# Altium project Aeroval-v2.PrjPcb
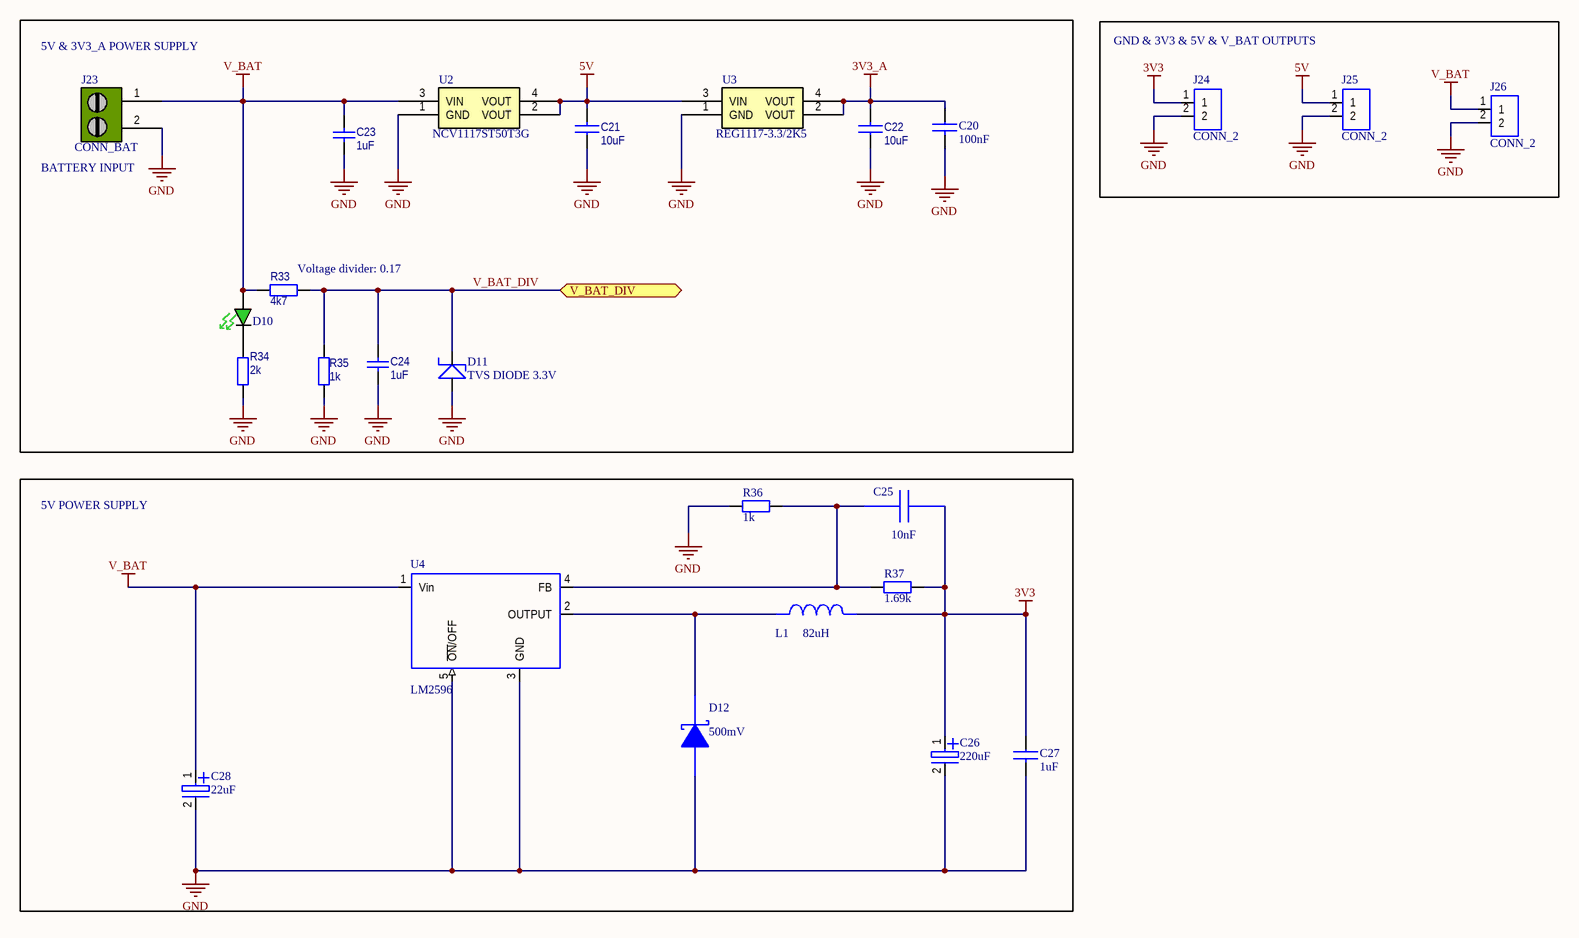
[diagram p0: Power_supply.SchDoc]
5 sheets, 208 parts. Net scope: flat (ports and power ports of the same name join across sheets).
Board files: Aeroval-v2-PCB1.PcbDoc, Aeroval-v2-PCB1-proto1.PcbDoc
Sheets:
  Power_supply.SchDoc
  Interfaces.SchDoc
  Sensors.SchDoc
  PWM.SchDoc
  uC.SchDoc

## Sheet Power_supply.SchDoc: Power supply
size A3; Author: Valentin Py; DrawnBy: Valentin Py; Engineer: Valentin Py; Address1: valentin.py@gmail.com; SheetNumber: 1; SheetTotal: 5; PageSetup: Record=PageOptions|CenterHorizontal=True|CenterVertical=True|PrintScale=0.24|XCorrection=1.00|YCorrection=1.00|PrintKind=0|BorderSize=5000000|LeftOffset=0|BottomOffset=0|Orientation=2|PaperLength=1000|PaperWidth=1000|Scale=100|PaperSource=7|PrintQuality=-4|MediaType=1|DitherType=10|PaperKind=A4|PrintScaleMode=1

### Parts
C20  100nF  [080503]
C21  10uF  [080501]
C22  10uF  [080501]
C23  1uF  [080503]
C24  1uF  [080503]
C25  10nF  [080503]
C26  220uF  [1411]
C27  1uF  [080503]
C28  22uF  [2413]
D10  LED  [LED_0805 - GREEN]  (value not drawn)
D11  TVS DIODE 3.3V  [SOD-523]
D12  value 500mV  [SMA]  (hidden comment: B230A-13-F)
J23  CONN_BAT  [SL508_2C]
J24  CONN_2  [640454-2]
J25  CONN_2  [640454-2]
J26  CONN_2  [640454-2]
L1  82uH  [L1]
R33  4k7  [060301]
R34  2k  [060301]
R35  1k  [060301]
R36  1k  [060301]
R37  1.69k  [060301]
U2  NCV1117ST50T3G  [SOT223]
U3  REG1117-3.3/2K5  [SOT223]
U4  LM2596  [TO263]

### Blocks framed on the sheet
GND & 3V3 & 5V & V_BAT OUTPUTS: J24-J26
5V POWER SUPPLY: C25-C28 D12 L1 R36 R37 U4

### Ports
V_BAT_DIV

### Nets
3V3: C25.1 C26.1 C27.1 J24.1 L1.2 R37.2
3V3_A: C20.1 C22.2 U3.2(VOUT) U3.4(VOUT)
5V: C21.2 J25.1 U2.2(VOUT) U2.4(VOUT) U3.3(VIN)
GND: C20.2 C21.1 C22.1 C23.2 C24.2 C26.2 C27.2 C28.2 D11.1 D12.2(A) J23.2 J24.2 J25.2 J26.2 R34.1 R35.2 R36.1 U2.1(GND) U3.1(GND) U4.3(GND) U4.5(~{ON}/OFF)
V_BAT: C23.1 C28.1 D10.A J23.1 J26.1 R33.2 U2.3(VIN) U4.1(Vin)
V_BAT_DIV: C24.1 D11.2 R33.1 R35.1 ; port V_BAT_DIV
NetC25_2: C25.2 R36.2 R37.1 U4.4(FB)
NetD10_C: D10.C R34.2
NetD12_1: D12.1(K) L1.1 U4.2(OUTPUT)

### Notes on the sheet
- (near J23) 5V & 3V3_A POWER SUPPLY
- (near J23) BATTERY INPUT
- (near R33) Voltage divider: 0.17
- Title
- Size:
- Date:
- A3
- Author:
- Time:
- Revision:
- Sheet
- of
- File:

### Library data of the parts
C20 = CAPA: CAP CER 0.1UF 25V 10% X7R 0805; Value: 100nF; Supplier 1: Digi-Key; Supplier Part Number 1: 1276-1099-1-ND
C21 C22 = CAPA: CAP CER 10UF 16V 20% X6S 0805; Value: 10uF; Supplier 1: Digi-Key; Supplier Part Number 1: 445-7612-1-ND
C23 C24 = Cap Semi: CAP CER 1UF 25V 10% X7R 0805; Value: 1uF; Supplier 1: Digi-Key; Supplier Part Number 1: 399-1168-1-ND
C25 = GRM216R71H103KA01D: CAP CER 10nF 50V 10% X7R 0805; Value: 10nF; Supplier 1: Digi-Key; Supplier Part Number 1: 399-1158-1-ND
C26 = CAPA_EL: CAP TANT 220UF 4V 20% 1411; Value: 220uF; Supplier 1: Digi-Key; Supplier Part Number 1: 399-4625-6-ND
C27 = CAPA: CAP CER 1UF 25V 10% X7R 0805; Value: 1uF; Supplier 1: Digi-Key; Supplier Part Number 1: 399-1168-1-ND
C28 = CAPA_EL: CAP TANT 22UF 25V 10% 2413; Value: 22uF; Supplier 1: Digi-Key; Supplier Part Number 1: 399-3746-1-ND
D10 = APT2012CGCK: LED 2X1.2MM 570NM GN WTR CLR SMD; Supplier 1: Digi-Key; Supplier Part Number 1: 754-1127-1-ND
D11 = Zener: TVS DIODE 3.3VWM 8VC SOD523; Supplier 1: Digi-Key; Supplier Part Number 1: 641-1395-1-ND
J23 = 282857-2: TERM BLOCK HDR 2POS R/A 5.08MM; Supplier 1: Digi-Key; Supplier Part Number 1: 281-1279-ND; Value: 282857-2
J24-J26 = CONN_2: CONN HEADER 2.54mm 2; Supplier 1: Stock
L1 = SDR1307-820KL: Value: 82uH; Supplier 1: Digi-Key; Supplier Part Number 1: SDR1307-820KLCT-ND
R33 = RES: RES 4.7K 1% 0603; Value: 4k7; Supplier 1: Digi-Key; Supplier Part Number 1: RMCF0603FT4K70CT-ND
R34 = RES: RES 2K 1% 0805; Value: 2k; Supplier 1: Digi-Key; Supplier Part Number 1: P2.00KHCT-ND
R35 R36 = RES: RES 1k 0805; Value: 1k; Supplier 1: Digi-Key
  R35: Supplier Part Number 1: P1.00KHDKR-ND
R37 = RES: RES 1.69K OHM 1% 1/8W 0805; Value: 1.69k; Supplier 1: Digi-Key; Supplier Part Number 1: P1.69KHCT-ND
U2 = NCV1117ST50T3G: Low Dropout (LDO) Regulators ANA 800mA LDO; Supplier 1: Digi-Key; Supplier Part Number 1: NCV1117ST50T3GOSCT-ND
U3 = NCV1117ST50T3G: IC REG LDO 3.3V 0.8A SOT223; Supplier 1: Digi-Key; Supplier Part Number 1: 296-21321-1-ND
U4 = LM2596: IC REG BUCK ADJ 3A TO263-5; Supplier 1: Digi-Key; Supplier Part Number 1: 296-35399-1-ND
D12 = B230A-13-F: Supplier 1: Digi-Key; Supplier Part Number 1: B230A-FDICT-ND

## Sheet Interfaces.SchDoc: Interfaces
size A3; Author: Valentin Py; DrawnBy: Valentin Py; Engineer: Valentin Py; Address1: valentin.py@gmail.com; SheetNumber: 3; SheetTotal: 5; PageSetup: Record=PageOptions|CenterHorizontal=True|CenterVertical=True|PrintScale=0.24|XCorrection=1.00|YCorrection=1.00|PrintKind=0|BorderSize=5000000|LeftOffset=0|BottomOffset=0|Orientation=2|PaperLength=1000|PaperWidth=1000|Scale=100|PaperSource=7|PrintQuality=-4|MediaType=1|DitherType=10|PaperKind=A4|PrintScaleMode=1
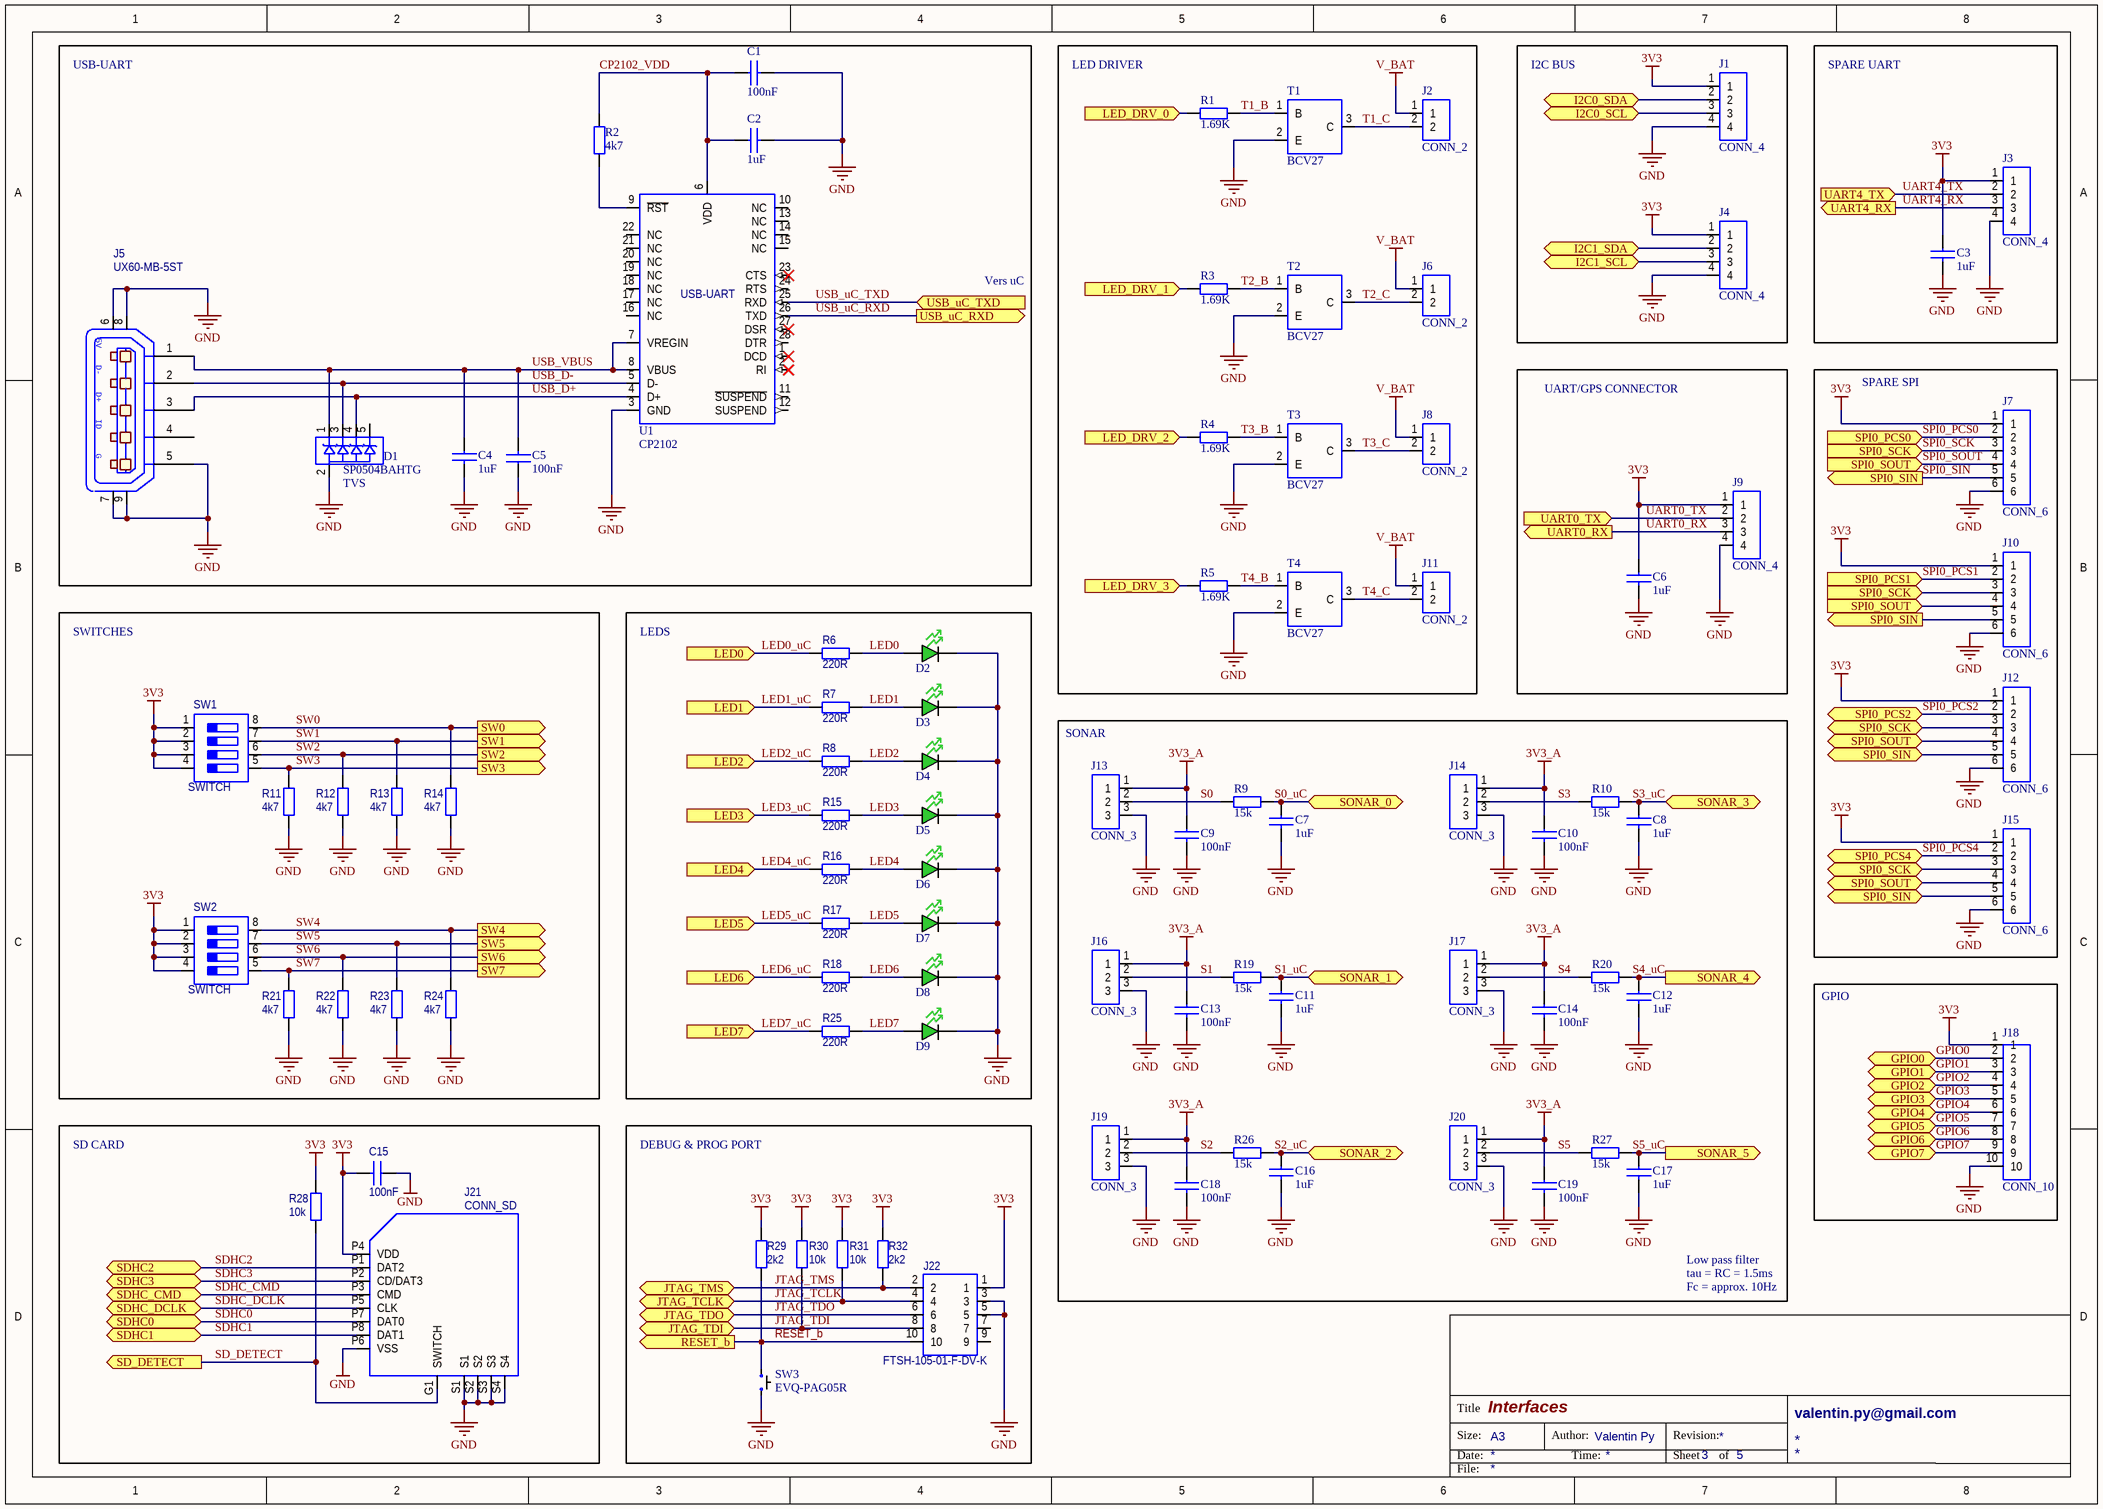
[diagram p1: Interfaces.SchDoc]

### Parts
C1  100nF  [080503]
C2  1uF  [080503]
C3  1uF  [080503]
C4  1uF  [080503]
C5  100nF  [080503]
C6  1uF  [080503]
C7  1uF  [080503]
C8  1uF  [080503]
C9  100nF  [080503]
C10  100nF  [080503]
C11  1uF  [080503]
C12  1uF  [080503]
C13  100nF  [080503]
C14  100nF  [080503]
C15  100nF  [080503]
C16  1uF  [080503]
C17  1uF  [080503]
C18  100nF  [080503]
C19  100nF  [080503]
D1  SP0504BAHTG  [SOT23501]
D2  LED  [LED_0805 - GREEN]  (value not drawn)
D3  LED  [LED_0805 - GREEN]  (value not drawn)
D4  LED  [LED_0805 - GREEN]  (value not drawn)
D5  LED  [LED_0805 - GREEN]  (value not drawn)
D6  LED  [LED_0805 - GREEN]  (value not drawn)
D7  LED  [LED_0805 - GREEN]  (value not drawn)
D8  LED  [LED_0805 - GREEN]  (value not drawn)
D9  LED  [LED_0805 - GREEN]  (value not drawn)
J1  CONN_4  [640454-4]
J2  CONN_2  [640454-2]
J3  CONN_4  [640454-4]
J4  CONN_4  [640454-4]
J5  UX60-MB-5ST  [USB/UX60-MB-5ST]
J6  CONN_2  [640454-2]
J7  CONN_6  [640454-6]
J8  CONN_2  [640454-2]
J9  CONN_4  [640454-4]
J10  CONN_6  [640454-6]
J11  CONN_2  [640454-2]
J12  CONN_6  [640454-6]
J13  CONN_3  [640454-3]
J14  CONN_3  [640454-3]
J15  CONN_6  [640454-6]
J16  CONN_3  [640454-3]
J17  CONN_3  [640454-3]
J18  CONN_10  [640454-10]
J19  CONN_3  [640454-3]
J20  CONN_3  [640454-3]
J21  CONN_SD  [con8_sdcard_push_sm]
J22  FTSH-105-01-F-DV-K  [FTSH-105-01-F-DV-K]
R1  1.69k  [060301]
R2  4k7  [060301]
R3  1.69k  [060301]
R4  1.69k  [060301]
R5  1.69k  [060301]
R6  220R  [060301]
R7  220R  [060301]
R8  220R  [060301]
R9  15k  [060301]
R10  15k  [060301]
R11  4k7  [060301]
R12  4k7  [060301]
R13  4k7  [060301]
R14  4k7  [060301]
R15  220R  [060301]
R16  220R  [060301]
R17  220R  [060301]
R18  220R  [060301]
R19  15k  [060301]
R20  15k  [060301]
R21  4k7  [060301]
R22  4k7  [060301]
R23  4k7  [060301]
R24  4k7  [060301]
R25  220R  [060301]
R26  15k  [060301]
R27  15k  [060301]
R28  10k  [060301]
R29  2k2  [060301]
R30  10k  [060301]
R31  10k  [060301]
R32  2k2  [060301]
SW1  SWITCH  [GDS04]
SW2  SWITCH  [GDS04]
SW3  EVQ-PAG05R  [EVQ-PAG05R]
T1  BCV27  [BCV27]
T2  BCV27  [BCV27]
T3  BCV27  [BCV27]
T4  BCV27  [BCV27]
U1  CP2102  [QFN-28]

### Blocks framed on the sheet
LED DRIVER: J2 J6 J8 J11 R1 R3-R5 T1-T4
I2C BUS: J1 J4
UART/GPS CONNECTOR: C6 J9
SPARE SPI: J7 J10 J12 J15
SWITCHES: R11-R14 R21-R24 SW1 SW2
LEDS: D2-D9 R6-R8 R15-R18 R25
GPIO: J18
SD CARD: C15 J21 R28
DEBUG & PROG PORT: J22 R29-R32 SW3

### Ports
GPIO0 (bidir), GPIO1 (bidir), GPIO2 (bidir), GPIO3 (bidir), GPIO4 (bidir), GPIO5 (bidir), GPIO6 (bidir), GPIO7 (bidir), I2C0_SCL (bidir), I2C0_SDA (bidir), I2C1_SCL, I2C1_SDA, JTAG_TCLK, JTAG_TDI, JTAG_TDO, JTAG_TMS, LED0 (in), LED1 (in), LED2 (in), LED3 (in), LED4 (in), LED5 (in), LED6 (in), LED7 (in), LED_DRV_0 (in), LED_DRV_1 (in), LED_DRV_2 (in), LED_DRV_3 (in), RESET_b (out), SD_DETECT (out), SDHC0, SDHC1, SDHC2, SDHC3, SDHC_CMD, SDHC_DCLK, SONAR_0, SONAR_1, SONAR_2, SONAR_3, SONAR_4 (out), SONAR_5 (out), SPI0_PCS0 (in), SPI0_PCS1 (in), SPI0_PCS2, SPI0_PCS4, SPI0_SCK, SPI0_SCK (in), SPI0_SIN, SPI0_SIN (out), SPI0_SOUT, SPI0_SOUT (in), SW0 (out), SW1 (out), SW2 (out), SW3 (out), SW4 (out), SW5 (out), SW6 (out), SW7 (out), UART0_RX (out), UART0_TX (in), UART4_RX (out), UART4_TX (in), USB_uC_RXD (out), USB_uC_TXD (in)

### Nets
3V3: C3.1 C6.1 C15.2 J1.1 J3.1 J4.1 J7.1 J9.1 J10.1 J12.1 J15.1 J18.1 J21.P4(VDD) J22.1 R28.1 R29.2 R30.1 R31.1 R32.2 SW1.1 SW1.2 SW1.3 SW1.4 SW2.1 SW2.2 SW2.3 SW2.4
3V3_A: C9.1 C10.1 C13.1 C14.1 C18.1 C19.1 J13.1 J14.1 J16.1 J17.1 J19.1 J20.1
GND: C1.2 C2.2 C3.2 C4.2 C5.1 C6.2 C7.2 C8.2 C9.2 C10.2 C11.2 C12.2 C13.2 C14.2 C15.1 C16.2 C17.2 C18.2 C19.2 D1.2 D2.C D3.C D4.C D5.C D6.C D7.C D8.C D9.C J1.4 J3.4 J4.4 J5.5(P5) J5.6(SHLD1) J5.7(SHLD2) J5.8(SHLD3) J5.9(SHLD4) J7.6 J9.4 J10.6 J12.6 J13.3 J14.3 J15.6 J16.3 J17.3 J18.10 J19.3 J20.3 J21.P6(VSS) J21.S1 J21.S2 J21.S3 J21.S4 J22.3 J22.5 R11.1 R12.1 R13.1 R14.1 R21.1 R22.1 R23.1 R24.1 SW3.B T1.2(E) T2.2(E) T3.2(E) T4.2(E) U1.3(GND)
V_BAT: J2.1 J6.1 J8.1 J11.1
CP2102_VDD: C1.1 C2.1 R2.2 U1.6(VDD)
GPIO0: J18.2 ; port GPIO0
GPIO1: J18.3 ; port GPIO1
GPIO2: J18.4 ; port GPIO2
GPIO3: J18.5 ; port GPIO3
GPIO4: J18.6 ; port GPIO4
GPIO5: J18.7 ; port GPIO5
GPIO6: J18.8 ; port GPIO6
GPIO7: J18.9 ; port GPIO7
I2C0_SCL: J1.3 ; port I2C0_SCL
I2C0_SDA: J1.2 ; port I2C0_SDA
I2C1_SCL: J4.3 ; port I2C1_SCL
I2C1_SDA: J4.2 ; port I2C1_SDA
JTAG_TCLK: J22.4 R31.2 ; port JTAG_TCLK
JTAG_TDI: J22.8 R30.2 ; port JTAG_TDI
JTAG_TDO: J22.6 ; port JTAG_TDO
JTAG_TMS: J22.2 R32.1 ; port JTAG_TMS
LED0: D2.A R6.2
LED0_uC: R6.1 ; port LED0
LED1: D3.A R7.2
LED1_uC: R7.1 ; port LED1
LED2: D4.A R8.2
LED2_uC: R8.1 ; port LED2
LED3: D5.A R15.2
LED3_uC: R15.1 ; port LED3
LED4: D6.A R16.2
LED4_uC: R16.1 ; port LED4
LED5: D7.A R17.2
LED5_uC: R17.1 ; port LED5
LED6: D8.A R18.2
LED6_uC: R18.1 ; port LED6
LED7: D9.A R25.2
LED7_uC: R25.1 ; port LED7
RESET_b: J22.10 R29.1 SW3.A ; port RESET_b
S0: J13.2 R9.1
S0_uC: C7.1 R9.2 ; port SONAR_0
S1: J16.2 R19.1
S1_uC: C11.1 R19.2 ; port SONAR_1
S2: J19.2 R26.1
S2_uC: C16.1 R26.2 ; port SONAR_2
S3: J14.2 R10.1
S3_uC: C8.1 R10.2 ; port SONAR_3
S4: J17.2 R20.1
S4_uC: C12.1 R20.2 ; port SONAR_4
S5: J20.2 R27.1
S5_uC: C17.1 R27.2 ; port SONAR_5
SD_DETECT: J21.G1(SWITCH) R28.2 ; port SD_DETECT
SDHC0: J21.P7(DAT0) ; port SDHC0
SDHC1: J21.P8(DAT1) ; port SDHC1
SDHC2: J21.P1(DAT2) ; port SDHC2
SDHC3: J21.P2(CD/DAT3) ; port SDHC3
SDHC_CMD: J21.P3(CMD) ; port SDHC_CMD
SDHC_DCLK: J21.P5(CLK) ; port SDHC_DCLK
SPI0_PCS0: J7.2 ; port SPI0_PCS0
SPI0_PCS1: J10.2 ; port SPI0_PCS1
SPI0_PCS2: J12.2 ; port SPI0_PCS2
SPI0_PCS4: J15.2 ; port SPI0_PCS4
SPI0_SCK: J7.3 J10.3 J12.3 J15.3 ; port SPI0_SCK
SPI0_SIN: J7.5 J10.5 J12.5 J15.5 ; port SPI0_SIN
SPI0_SOUT: J7.4 J10.4 J12.4 J15.4 ; port SPI0_SOUT
SW0: R14.2 SW1.8 ; port SW0
SW1: R13.2 SW1.7 ; port SW1
SW2: R12.2 SW1.6 ; port SW2
SW3: R11.2 SW1.5 ; port SW3
SW4: R24.2 SW2.8 ; port SW4
SW5: R23.2 SW2.7 ; port SW5
SW6: R22.2 SW2.6 ; port SW6
SW7: R21.2 SW2.5 ; port SW7
T1_B: R1.2 T1.1(B)
T1_C: J2.2 T1.3(C)
T2_B: R3.2 T2.1(B)
T2_C: J6.2 T2.3(C)
T3_B: R4.2 T3.1(B)
T3_C: J8.2 T3.3(C)
T4_B: R5.2 T4.1(B)
T4_C: J11.2 T4.3(C)
UART0_RX: J9.3 ; port UART0_RX
UART0_TX: J9.2 ; port UART0_TX
UART4_RX: J3.3 ; port UART4_RX
UART4_TX: J3.2 ; port UART4_TX
USB_D+: D1.4 J5.3(P3) U1.4(D+)
USB_D-: D1.3 J5.2(P2) U1.5(D-)
USB_uC_RXD: U1.26(TXD) ; port USB_uC_RXD
USB_uC_TXD: U1.25(RXD) ; port USB_uC_TXD
USB_VBUS: C4.1 C5.2 D1.1 J5.1(P1) U1.7(VREGIN) U1.8(VBUS)
NetR1_1: R1.1 ; port LED_DRV_0
NetR2_1: R2.1 U1.9(~{RST})
NetR3_1: R3.1 ; port LED_DRV_1
NetR4_1: R4.1 ; port LED_DRV_2
NetR5_1: R5.1 ; port LED_DRV_3

Not connected (* = marked no-connect by the designer): D1 5; J5 4(P4); J22 7 9; U1 1(DCD)* 2(RI)* 10(NC) 11(~{SUSPEND}) 12(SUSPEND) 13(NC) 14(NC) 15(NC) 16(NC) 17(NC) 18(NC) 19(NC) 20(NC) 21(NC) 22(NC) 23(CTS)* 24(RTS) 27(DSR)* 28(DTR)

### Notes on the sheet
- USB-UART
- SPARE UART
- Vers uC
- (near D1) TVS
- (near J13) SONAR
- Low pass filter
- tau = RC = 1.5ms
- Fc = approx. 10Hz
- Title
- Size:
- Date:
- A3
- Author:
- Time:
- Revision:
- Sheet
- of
- File:
- (in symbol CP2102) USB-UART
- (in symbol USB_MINI_AB_RECEPTACLE) 5V; D-; D+; ID; G

### Library data of the parts
C1 C5 C9 C10 C13-C15 C18 C19 = CAPA: CAP CER 0.1UF 25V 10% X7R 0805; Value: 100nF; Supplier 1: Digi-Key; Supplier Part Number 1: 1276-1099-1-ND
C2-C4 C6-C8 C11 C12 C16 C17 = CAPA: CAP CER 1UF 25V 10% X7R 0805; Value: 1uF; Supplier 1: Digi-Key; Supplier Part Number 1: 399-1168-1-ND
D1 = SP0504BAHTG: TVS AVAL DIODE ARRAY 4CH, 5.5V; Supplier 1: Digi-Key; Supplier Part Number 1: F3157CT-ND
D2-D9 = APT2012CGCK: LED 2X1.2MM 570NM GN WTR CLR SMD; Supplier 1: Digi-Key; Supplier Part Number 1: 754-1127-1-ND
J2 J6 J8 J11 = CONN_2: CONN HEADER 2.54mm 2; Supplier 1: Stock
J3 J9 = CONN_4: CONN HEADER 2.54mm 4; Supplier 1: Stock
J5 = USB_MINI_AB_RECEPTACLE: CONN RECEPT MINI B USB2.0; Supplier 1: Digi-Key; Supplier Part Number 1: H2959CT-ND
J13 J14 J16 J17 J19 J20 = CONN_3: CONN HEADER 2.54mm 3
  J13 J14 J16 J19: Supplier 1: Stocks
  J17 J20: Supplier 1: Stock
J21 = CON8_SDCARD_SW: CON 8 SD CARD PUSH SMT 1.1MM SP 75H AU; Supplier 1: Digi-Key; Supplier Part Number 1: WM6825CT-ND
J22 = CON10A: CONN HEADER 10POS DUAL .05" SMD; Supplier 1: Digi-Key; Supplier Part Number 1: FTSH-105-01-F-DV-K-ND
R1 R3-R5 = RES: RES 1.69K OHM 1% 1/8W 0805; Value: 1.69K; Supplier 1: Digi-Key; Supplier Part Number 1: P1.69KHCT-ND
R2 R11-R14 R21-R24 = RES: RES 4.7K 0805; Value: 4k7; Supplier 1: Digi-Key; Supplier Part Number 1: RMCF0603FT4K70CT-ND
R6-R8 R15-R18 R25 = RES: RES 220R 0805; Value: 220R; Supplier 1: Digi-Key; Supplier Part Number 1: RMCF0603FT220RCT-ND
R9 R10 R19 R20 R26 R27 = RES: RES 15K 0805; Value: 15k; Supplier 1: Digi-Key; Supplier Part Number 1: RHM15.0KCFCT-ND
R28 R30 R31 = RES: RES 10K 0805; Value: 10k; Supplier 1: Digi-Key; Supplier Part Number 1: RHM10.0KCFCT-ND
R29 R32 = RES: RES 2.2k 0805; Value: 2k2; Supplier 1: Digi-Key; Supplier Part Number 1: RMCF0603FT2K20CT-ND
SW1 SW2 = SW DIP-4: SWITCH DIP TOP SLIDE 4POS SMD; Supplier 1: Digi-Key; Supplier Part Number 1: CKN6068-ND
SW3 = EVQ-PAG05R: SWITCH LT 6MM 260GF 5MM HEIGHT; Value: EVQ-PAG05R; Supplier 1: Digi-Key; Supplier Part Number 1: P12195S-ND
T1-T4 = BCV27: TRANS NPN DARL 30V 1.2A SOT23; Supplier 1: Digi-Key; Supplier Part Number 1: BCV27CT-ND
U1 = CP2102: Single-Chip USB to UART Bridge; Value: *; Supplier 1: Digi-Key; Supplier Part Number 1: 336-1160-5-ND

## Sheet Sensors.SchDoc: Sensors
size A3; Author: Valentin Py; DrawnBy: Valentin Py; Engineer: Valentin Py; Address1: valentin.py@gmail.com; SheetNumber: 2; SheetTotal: 5; PageSetup: Record=PageOptions|CenterHorizontal=True|CenterVertical=True|PrintScale=0.24|XCorrection=1.00|YCorrection=1.00|PrintKind=0|BorderSize=5000000|LeftOffset=0|BottomOffset=0|Orientation=2|PaperLength=1000|PaperWidth=1000|Scale=100|PaperSource=7|PrintQuality=-4|MediaType=1|DitherType=10|PaperKind=A4|PrintScaleMode=1
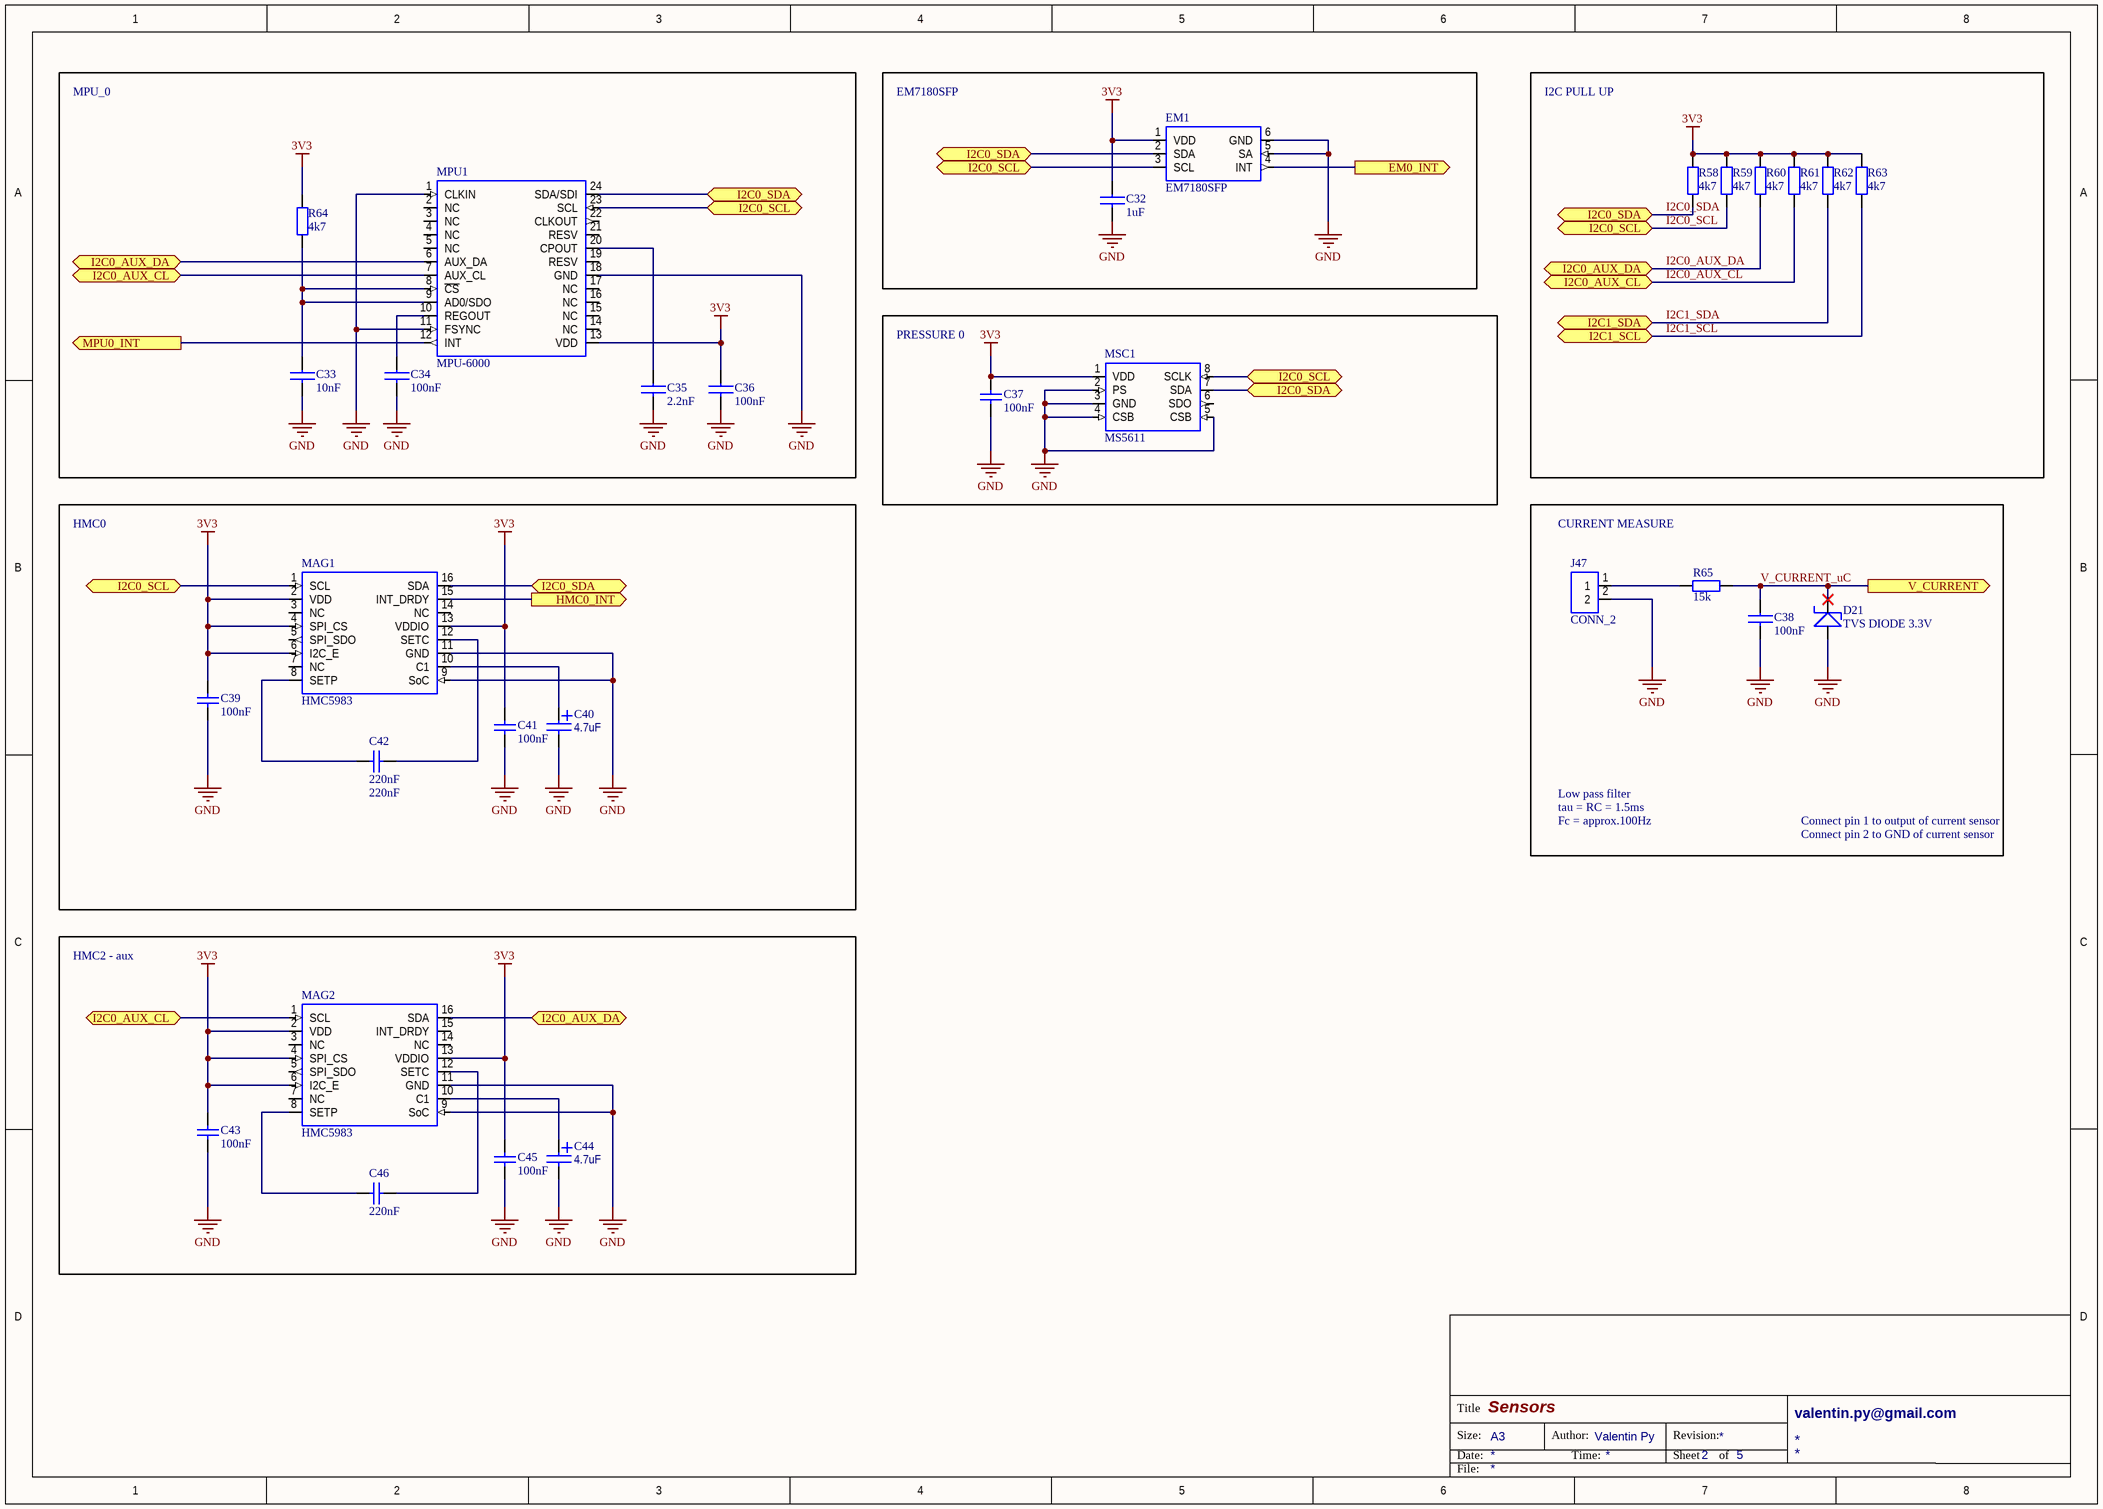
[diagram p2: Sensors.SchDoc]

### Parts
C32  1uF  [080503]
C33  10nF  [080503]
C34  100nF  [080503]
C35  2.2nF  [080503]
C36  100nF  [080503]
C37  100nF  [080503]
C38  100nF  [080503]
C39  100nF  [080503]
C40  4.7uF  [120605]
C41  100nF  [080503]
C42  220nF  [080503]
C43  100nF  [080503]
C44  4.7uF  [120605]
C45  100nF  [080503]
C46  220nF  [080503]
D21  TVS DIODE 3.3V  [SOD-523]
EM1  EM7180SFP  [EM7180SFP]
J47  CONN_2  [640454-2]
MAG1  HMC5983  [QFN16]
MAG2  HMC5983  [QFN16]
MPU1  MPU-6000  [QFN24]
MSC1  MS5611  [MS5611]
R58  4k7  [060301]
R59  4k7  [060301]
R60  4k7  [060301]
R61  4k7  [060301]
R62  4k7  [060301]
R63  4k7  [060301]
R64  4k7  [060301]
R65  15k  [060301]

### Blocks framed on the sheet
MPU_0: C33-C36 MPU1 R64
EM7180SFP: C32 EM1
I2C PULL UP: R58-R63
PRESSURE 0: C37 MSC1
HMC0: C39-C42 MAG1
HMC2 - aux: C43-C46 MAG2

### Ports
EM0_INT (out), HMC0_INT (out), I2C0_AUX_CL (bidir), I2C0_AUX_DA (bidir), I2C0_SCL (bidir), I2C0_SDA (bidir), I2C1_SCL, I2C1_SDA, MPU0_INT (out), V_CURRENT (out)

### Nets
3V3: C32.1 C36.1 C37.2 C39.1 C41.1 C43.1 C45.1 EM1.1(VDD) MAG1.2(VDD) MAG1.4(SPI_CS) MAG1.6(I2C_E) MAG1.13(VDDIO) MAG2.2(VDD) MAG2.4(SPI_CS) MAG2.6(I2C_E) MAG2.13(VDDIO) MPU1.13(VDD) MSC1.1(VDD) R58.2 R59.2 R60.2 R61.2 R62.2 R63.2 R64.2
GND: C32.2 C33.2 C34.2 C35.2 C36.2 C37.1 C38.2 C39.2 C40.2 C41.2 C43.2 C44.2 C45.2 D21.1 EM1.5(SA) EM1.6(GND) J47.2 MAG1.9(SoC) MAG1.11(GND) MAG2.9(SoC) MAG2.11(GND) MPU1.1(CLKIN) MPU1.11(FSYNC) MPU1.18(GND) MSC1.2(PS) MSC1.3(GND) MSC1.4(CSB) MSC1.5(CSB)
I2C0_AUX_CL: MAG2.1(SCL) MPU1.7(AUX_CL) R61.1 ; port I2C0_AUX_CL
I2C0_AUX_DA: MAG2.16(SDA) MPU1.6(AUX_DA) R60.1 ; port I2C0_AUX_DA
I2C0_SCL: EM1.3(SCL) MAG1.1(SCL) MPU1.23(SCL) MSC1.8(SCLK) R59.1 ; port I2C0_SCL
I2C0_SDA: EM1.2(SDA) MAG1.16(SDA) MPU1.24(SDA/SDI) MSC1.7(SDA) R58.1 ; port I2C0_SDA
I2C1_SCL: R63.1 ; port I2C1_SCL
I2C1_SDA: R62.1 ; port I2C1_SDA
V_CURRENT_uC: C38.1 D21.2 R65.2 ; port V_CURRENT
NetC33_1: C33.1 MPU1.8(~{CS}) MPU1.9(AD0/SDO) R64.1
NetC34_1: C34.1 MPU1.10(REGOUT)
NetC35_1: C35.1 MPU1.20(CPOUT)
NetC40_1: C40.1 MAG1.10(C1)
NetC42_1: C42.1 MAG1.12(SETC)
NetC42_2: C42.2 MAG1.8(SETP)
NetC44_1: C44.1 MAG2.10(C1)
NetC46_1: C46.1 MAG2.12(SETC)
NetC46_2: C46.2 MAG2.8(SETP)
NetEM1_4: EM1.4(INT) ; port EM0_INT
NetJ47_1: J47.1 R65.1
NetMAG1_15: MAG1.15(INT_DRDY) ; port HMC0_INT
NetMPU1_12: MPU1.12(INT) ; port MPU0_INT

Not connected (* = marked no-connect by the designer): MAG1 3(NC) 5(SPI_SDO) 7(NC) 14(NC); MAG2 3(NC) 5(SPI_SDO) 7(NC) 14(NC) 15(INT_DRDY); MPU1 2(NC) 3(NC) 4(NC) 5(NC) 14(NC) 15(NC) 16(NC) 17(NC) 19(RESV) 21(RESV) 22(CLKOUT); MSC1 6(SDO)

### Notes on the sheet
- CURRENT MEASURE
- Low pass filter
- tau = RC = 1.5ms
- Fc = approx.100Hz
- Connect pin 1 to output of current sensor
- Connect pin 2 to GND of current sensor
- Title
- Size:
- Date:
- A3
- Author:
- Time:
- Revision:
- Sheet
- of
- File:

### Library data of the parts
C32 = CAPA: CAP CER 1UF 25V 10% X7R 0805; Value: 1uF; Supplier 1: Digi-Key; Supplier Part Number 1: 399-1168-1-ND
C33 = CAPA: CAP CER 10nF 50V 10% X7R 0805; Value: 10nF; Supplier 1: Digi-Key; Supplier Part Number 1: 399-1158-1-ND
C34 C36 C38 = CAPA: CAP CER 0.1UF 25V 10% X7R 0805; Value: 100nF; Supplier 1: Digi-Key; Supplier Part Number 1: 1276-1099-1-ND
C35 = CAPA: CAP CER 2.2nF 50V; Value: 2.2nF; Supplier 1: Digi-Key; Supplier Part Number 1: 399-11167-2-ND
C37 C39 C41 C43 C45 = CAP: CAP CER 0.1UF 25V 10% X7R 0805; Value: 100nF; Supplier 1: Digi-Key; Supplier Part Number 1: 1276-1099-1-ND
C40 C44 = CAPA_T: CAP TANT 4.7uF 10V 10% 1206; Value: 4.7uF; Supplier 1: Digi-Key; Supplier Part Number 1: 399-3696-1-ND
C42 C46 = CAP: CAP CER 0.22uF 50V X7R 10% 0805; Value: 220nF; Supplier 1: Digi-Key; Supplier Part Number 1: 399-3491-1-ND
D21 = Zener: TVS DIODE 3.3VWM 8VC SOD523; Supplier 1: Digi-Key; Supplier Part Number 1: 641-1395-1-ND
J47 = CONN_2: CONN HEADER 2.54mm 2; Supplier 1: Stock
MAG1 MAG2 = HMC5983: IC COMPASS 3 AXIS 16-LCC; Supplier 1: Digi-Key; Supplier Part Number 1: 342-1092-1-ND
MPU1 = MPU-6000: GYRO/ACCELEROMETER 6AXIS 24QFN; Supplier 1: Digi-Key; Supplier Part Number 1: 1428-1005-1-ND
R58-R64 = RES: RES 4.7K 0805; Value: 4k7; Supplier 1: Digi-Key; Supplier Part Number 1: RMCF0603FT4K70CT-ND
R65 = RES: RES 15K 0805; Value: 15k; Supplier 1: Digi-Key; Supplier Part Number 1: RHM15.0KCFCT-ND

## Sheet PWM.SchDoc: PWM Connectors
size A3; Author: Valentin Py; DrawnBy: Valentin Py; Engineer: Valentin Py; Address1: valentin.py@gmail.com; SheetNumber: 5; SheetTotal: 5; PageSetup: Record=PageOptions|CenterHorizontal=True|CenterVertical=True|PrintScale=0.24|XCorrection=1.00|YCorrection=1.00|PrintKind=0|BorderSize=5000000|LeftOffset=0|BottomOffset=0|Orientation=2|PaperLength=1000|PaperWidth=1000|Scale=100|PaperSource=7|PrintQuality=-4|MediaType=1|DitherType=10|PaperKind=A4|PrintScaleMode=1
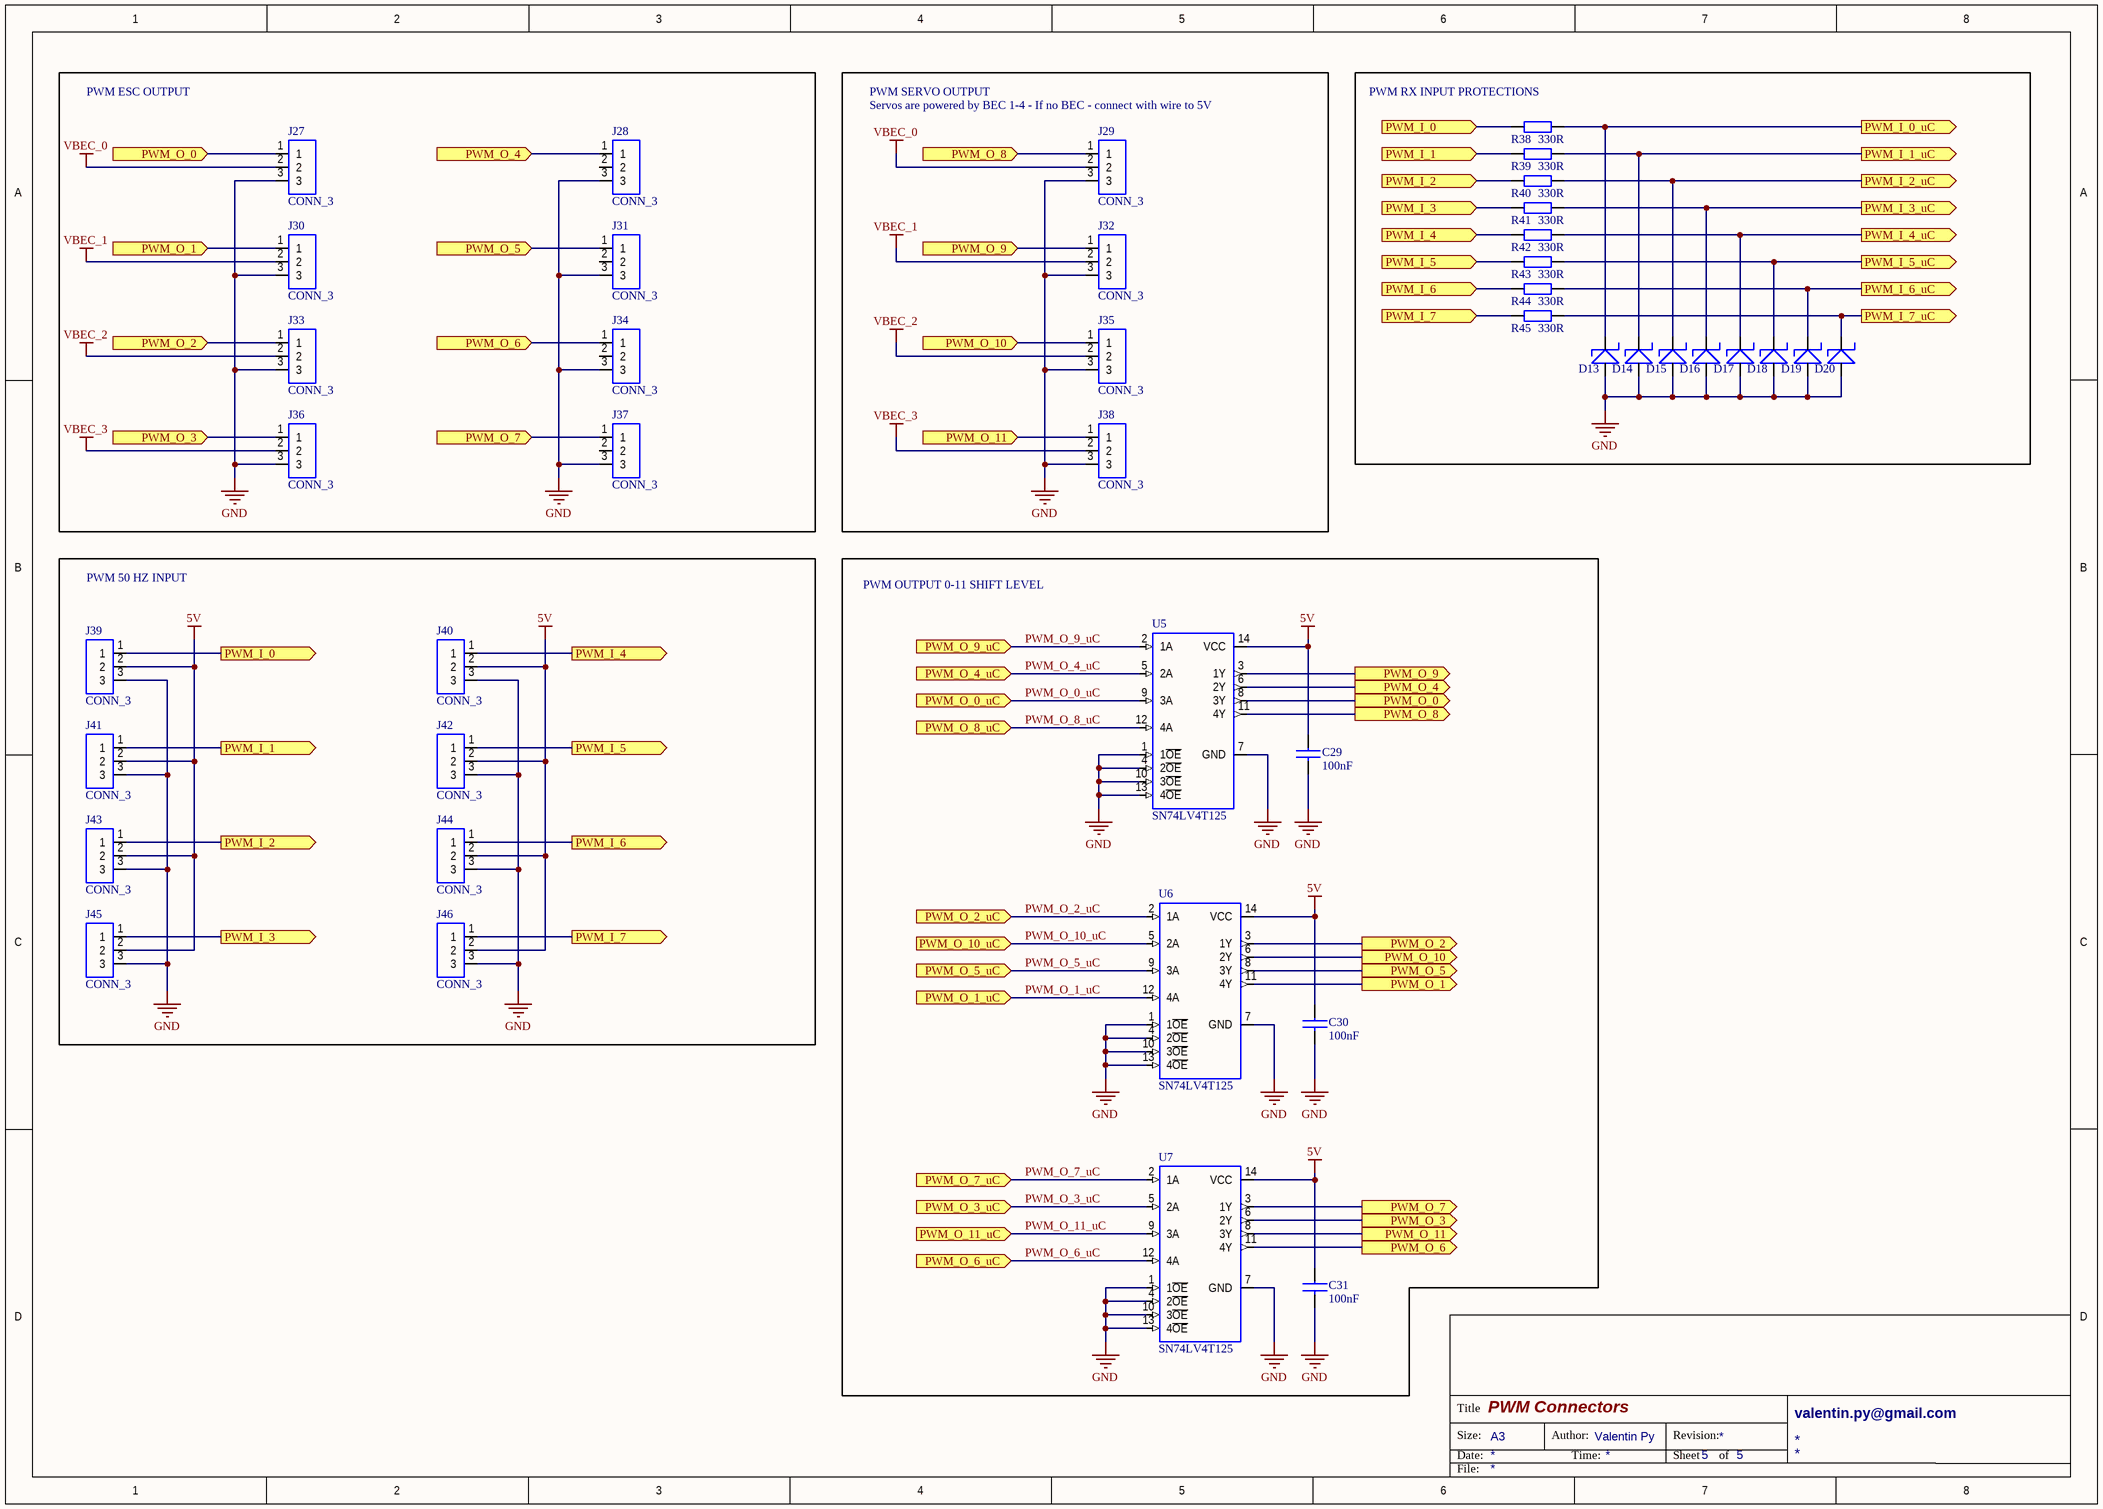
[diagram p3: PWM.SchDoc]

### Parts
C29  100nF  [080503]
C30  100nF  [080503]
C31  100nF  [080503]
D13  TVS DIODE 3.3V  [SOD-523]  (value not drawn)
D14  TVS DIODE 3.3V  [SOD-523]  (value not drawn)
D15  TVS DIODE 3.3V  [SOD-523]  (value not drawn)
D16  TVS DIODE 3.3V  [SOD-523]  (value not drawn)
D17  TVS DIODE 3.3V  [SOD-523]  (value not drawn)
D18  TVS DIODE 3.3V  [SOD-523]  (value not drawn)
D19  TVS DIODE 3.3V  [SOD-523]  (value not drawn)
D20  TVS DIODE 3.3V  [SOD-523]  (value not drawn)
J27  CONN_3  [640454-3]
J28  CONN_3  [640454-3]
J29  CONN_3  [640454-3]
J30  CONN_3  [640454-3]
J31  CONN_3  [640454-3]
J32  CONN_3  [640454-3]
J33  CONN_3  [640454-3]
J34  CONN_3  [640454-3]
J35  CONN_3  [640454-3]
J36  CONN_3  [640454-3]
J37  CONN_3  [640454-3]
J38  CONN_3  [640454-3]
J39  CONN_3  [640454-3]
J40  CONN_3  [640454-3]
J41  CONN_3  [640454-3]
J42  CONN_3  [640454-3]
J43  CONN_3  [640454-3]
J44  CONN_3  [640454-3]
J45  CONN_3  [640454-3]
J46  CONN_3  [640454-3]
R38  330R  [060301]
R39  330R  [060301]
R40  330R  [060301]
R41  330R  [060301]
R42  330R  [060301]
R43  330R  [060301]
R44  330R  [060301]
R45  330R  [060301]
U5  SN74LV4T125  [TSSOP14]
U6  SN74LV4T125  [TSSOP14]
U7  SN74LV4T125  [TSSOP14]

### Blocks framed on the sheet
PWM ESC OUTPUT: J27 J28 J30 J31 J33 J34 J36 J37
PWM RX INPUT PROTECTIONS: D13-D20 R38-R45
PWM 50 HZ INPUT: J39-J46
PWM OUTPUT 0-11 SHIFT LEVEL: C29-C31 U5-U7

### Ports
PWM_I_0 (in), PWM_I_0 (out), PWM_I_0_uC (out), PWM_I_1 (in), PWM_I_1 (out), PWM_I_1_uC (out), PWM_I_2 (in), PWM_I_2 (out), PWM_I_2_uC (out), PWM_I_3 (in), PWM_I_3 (out), PWM_I_3_uC (out), PWM_I_4 (in), PWM_I_4 (out), PWM_I_4_uC (out), PWM_I_5 (in), PWM_I_5 (out), PWM_I_5_uC (out), PWM_I_6 (in), PWM_I_6 (out), PWM_I_6_uC (out), PWM_I_7 (in), PWM_I_7 (out), PWM_I_7_uC (out), PWM_O_0 (in), PWM_O_0 (out), PWM_O_0_uC (in), PWM_O_1 (in), PWM_O_1 (out), PWM_O_1_uC (in), PWM_O_2 (in), PWM_O_2 (out), PWM_O_2_uC (in), PWM_O_3 (in), PWM_O_3 (out), PWM_O_3_uC (in), PWM_O_4 (in), PWM_O_4 (out), PWM_O_4_uC (in), PWM_O_5 (in), PWM_O_5 (out), PWM_O_5_uC (in), PWM_O_6 (in), PWM_O_6 (out), PWM_O_6_uC (in), PWM_O_7 (in), PWM_O_7 (out), PWM_O_7_uC (in), PWM_O_8 (in), PWM_O_8 (out), PWM_O_8_uC (in), PWM_O_9 (in), PWM_O_9 (out), PWM_O_9_uC (in), PWM_O_10 (in), PWM_O_10 (out), PWM_O_10_uC (in), PWM_O_11 (in), PWM_O_11 (out), PWM_O_11_uC (in)

### Nets
5V: C29.1 C30.1 C31.1 J39.2 J40.2 J41.2 J42.2 J43.2 J44.2 J45.2 J46.2 U5.14(VCC) U6.14(VCC) U7.14(VCC)
GND: C29.2 C30.2 C31.2 D13.1 D14.1 D15.1 D16.1 D17.1 D18.1 D19.1 D20.1 J27.3 J28.3 J29.3 J30.3 J31.3 J32.3 J33.3 J34.3 J35.3 J36.3 J37.3 J38.3 J39.3 J40.3 J41.3 J42.3 J43.3 J44.3 J45.3 J46.3 U5.1(1~{OE}) U5.4(2~{OE}) U5.7(GND) U5.10(3~{OE}) U5.13(4~{OE}) U6.1(1~{OE}) U6.4(2~{OE}) U6.7(GND) U6.10(3~{OE}) U6.13(4~{OE}) U7.1(1~{OE}) U7.4(2~{OE}) U7.7(GND) U7.10(3~{OE}) U7.13(4~{OE})
VBEC_0: J27.2 J29.2
VBEC_1: J30.2 J32.2
VBEC_2: J33.2 J35.2
VBEC_3: J36.2 J38.2
PWM_O_0_uC: U5.9(3A) ; port PWM_O_0_uC
PWM_O_1_uC: U6.12(4A) ; port PWM_O_1_uC
PWM_O_2_uC: U6.2(1A) ; port PWM_O_2_uC
PWM_O_3_uC: U7.5(2A) ; port PWM_O_3_uC
PWM_O_4_uC: U5.5(2A) ; port PWM_O_4_uC
PWM_O_5_uC: U6.9(3A) ; port PWM_O_5_uC
PWM_O_6_uC: U7.12(4A) ; port PWM_O_6_uC
PWM_O_7_uC: U7.2(1A) ; port PWM_O_7_uC
PWM_O_8_uC: U5.12(4A) ; port PWM_O_8_uC
PWM_O_9_uC: U5.2(1A) ; port PWM_O_9_uC
PWM_O_10_uC: U6.5(2A) ; port PWM_O_10_uC
PWM_O_11_uC: U7.9(3A) ; port PWM_O_11_uC
NetD13_2: D13.2 R38.1 ; port PWM_I_0_uC
NetD14_2: D14.2 R39.1 ; port PWM_I_1_uC
NetD15_2: D15.2 R40.1 ; port PWM_I_2_uC
NetD16_2: D16.2 R41.1 ; port PWM_I_3_uC
NetD17_2: D17.2 R42.1 ; port PWM_I_4_uC
NetD18_2: D18.2 R43.1 ; port PWM_I_5_uC
NetD19_2: D19.2 R44.1 ; port PWM_I_6_uC
NetD20_2: D20.2 R45.1 ; port PWM_I_7_uC
NetJ27_1: J27.1 U5.8(3Y) ; port PWM_O_0
NetJ28_1: J28.1 U5.6(2Y) ; port PWM_O_4
NetJ29_1: J29.1 U5.11(4Y) ; port PWM_O_8
NetJ30_1: J30.1 U6.11(4Y) ; port PWM_O_1
NetJ31_1: J31.1 U6.8(3Y) ; port PWM_O_5
NetJ32_1: J32.1 U5.3(1Y) ; port PWM_O_9
NetJ33_1: J33.1 U6.3(1Y) ; port PWM_O_2
NetJ34_1: J34.1 U7.11(4Y) ; port PWM_O_6
NetJ35_1: J35.1 U6.6(2Y) ; port PWM_O_10
NetJ36_1: J36.1 U7.6(2Y) ; port PWM_O_3
NetJ37_1: J37.1 U7.3(1Y) ; port PWM_O_7
NetJ38_1: J38.1 U7.8(3Y) ; port PWM_O_11
NetJ39_1: J39.1 R38.2 ; port PWM_I_0
NetJ40_1: J40.1 R42.2 ; port PWM_I_4
NetJ41_1: J41.1 R39.2 ; port PWM_I_1
NetJ42_1: J42.1 R43.2 ; port PWM_I_5
NetJ43_1: J43.1 R40.2 ; port PWM_I_2
NetJ44_1: J44.1 R44.2 ; port PWM_I_6
NetJ45_1: J45.1 R41.2 ; port PWM_I_3
NetJ46_1: J46.1 R45.2 ; port PWM_I_7

Not connected (* = marked no-connect by the designer): J28 2; J31 2; J34 2; J37 2

### Notes on the sheet
- PWM SERVO OUTPUT
- (near J29) Servos are powered by BEC 1-4 - If no BEC - connect with wire to 5V
- Title
- Size:
- Date:
- A3
- Author:
- Time:
- Revision:
- Sheet
- of
- File:

### Library data of the parts
C29-C31 = CAPA: CAP CER 0.1UF 25V 10% X7R 0805; Value: 100nF; Supplier 1: Digi-Key; Supplier Part Number 1: 1276-1099-1-ND
D13-D20 = Zener: TVS DIODE 3.3VWM 8VC SOD523; Supplier 1: Digi-Key; Supplier Part Number 1: 641-1395-1-ND
J27-J46 = CONN_3: CONN HEADER 2.54mm 3; Supplier 1: Stock
R38-R45 = RES: RES 330R 0805; Value: 330R; Supplier 1: Digi-Key; Supplier Part Number 1: RHM330CFCT-ND
U5-U7 = SN74LV4T125: IC BUFF/DVR NON-INVERT 14TSSOP; Supplier 1: Digi-Key; Supplier Part Number 1: 296-40545-1-ND

## Sheet uC.SchDoc: Microcontroller
size A3; Author: Valentin Py; DrawnBy: Valentin Py; Engineer: Valentin Py; Address1: valentin.py@gmail.com; SheetNumber: 4; SheetTotal: 5; PageSetup: Record=PageOptions|CenterHorizontal=True|CenterVertical=True|PrintScale=0.24|XCorrection=1.00|YCorrection=1.00|PrintKind=0|BorderSize=5000000|LeftOffset=0|BottomOffset=0|Orientation=2|PaperLength=1000|PaperWidth=1000|Scale=100|PaperSource=7|PrintQuality=-4|MediaType=1|DitherType=10|PaperKind=A4|PrintScaleMode=1
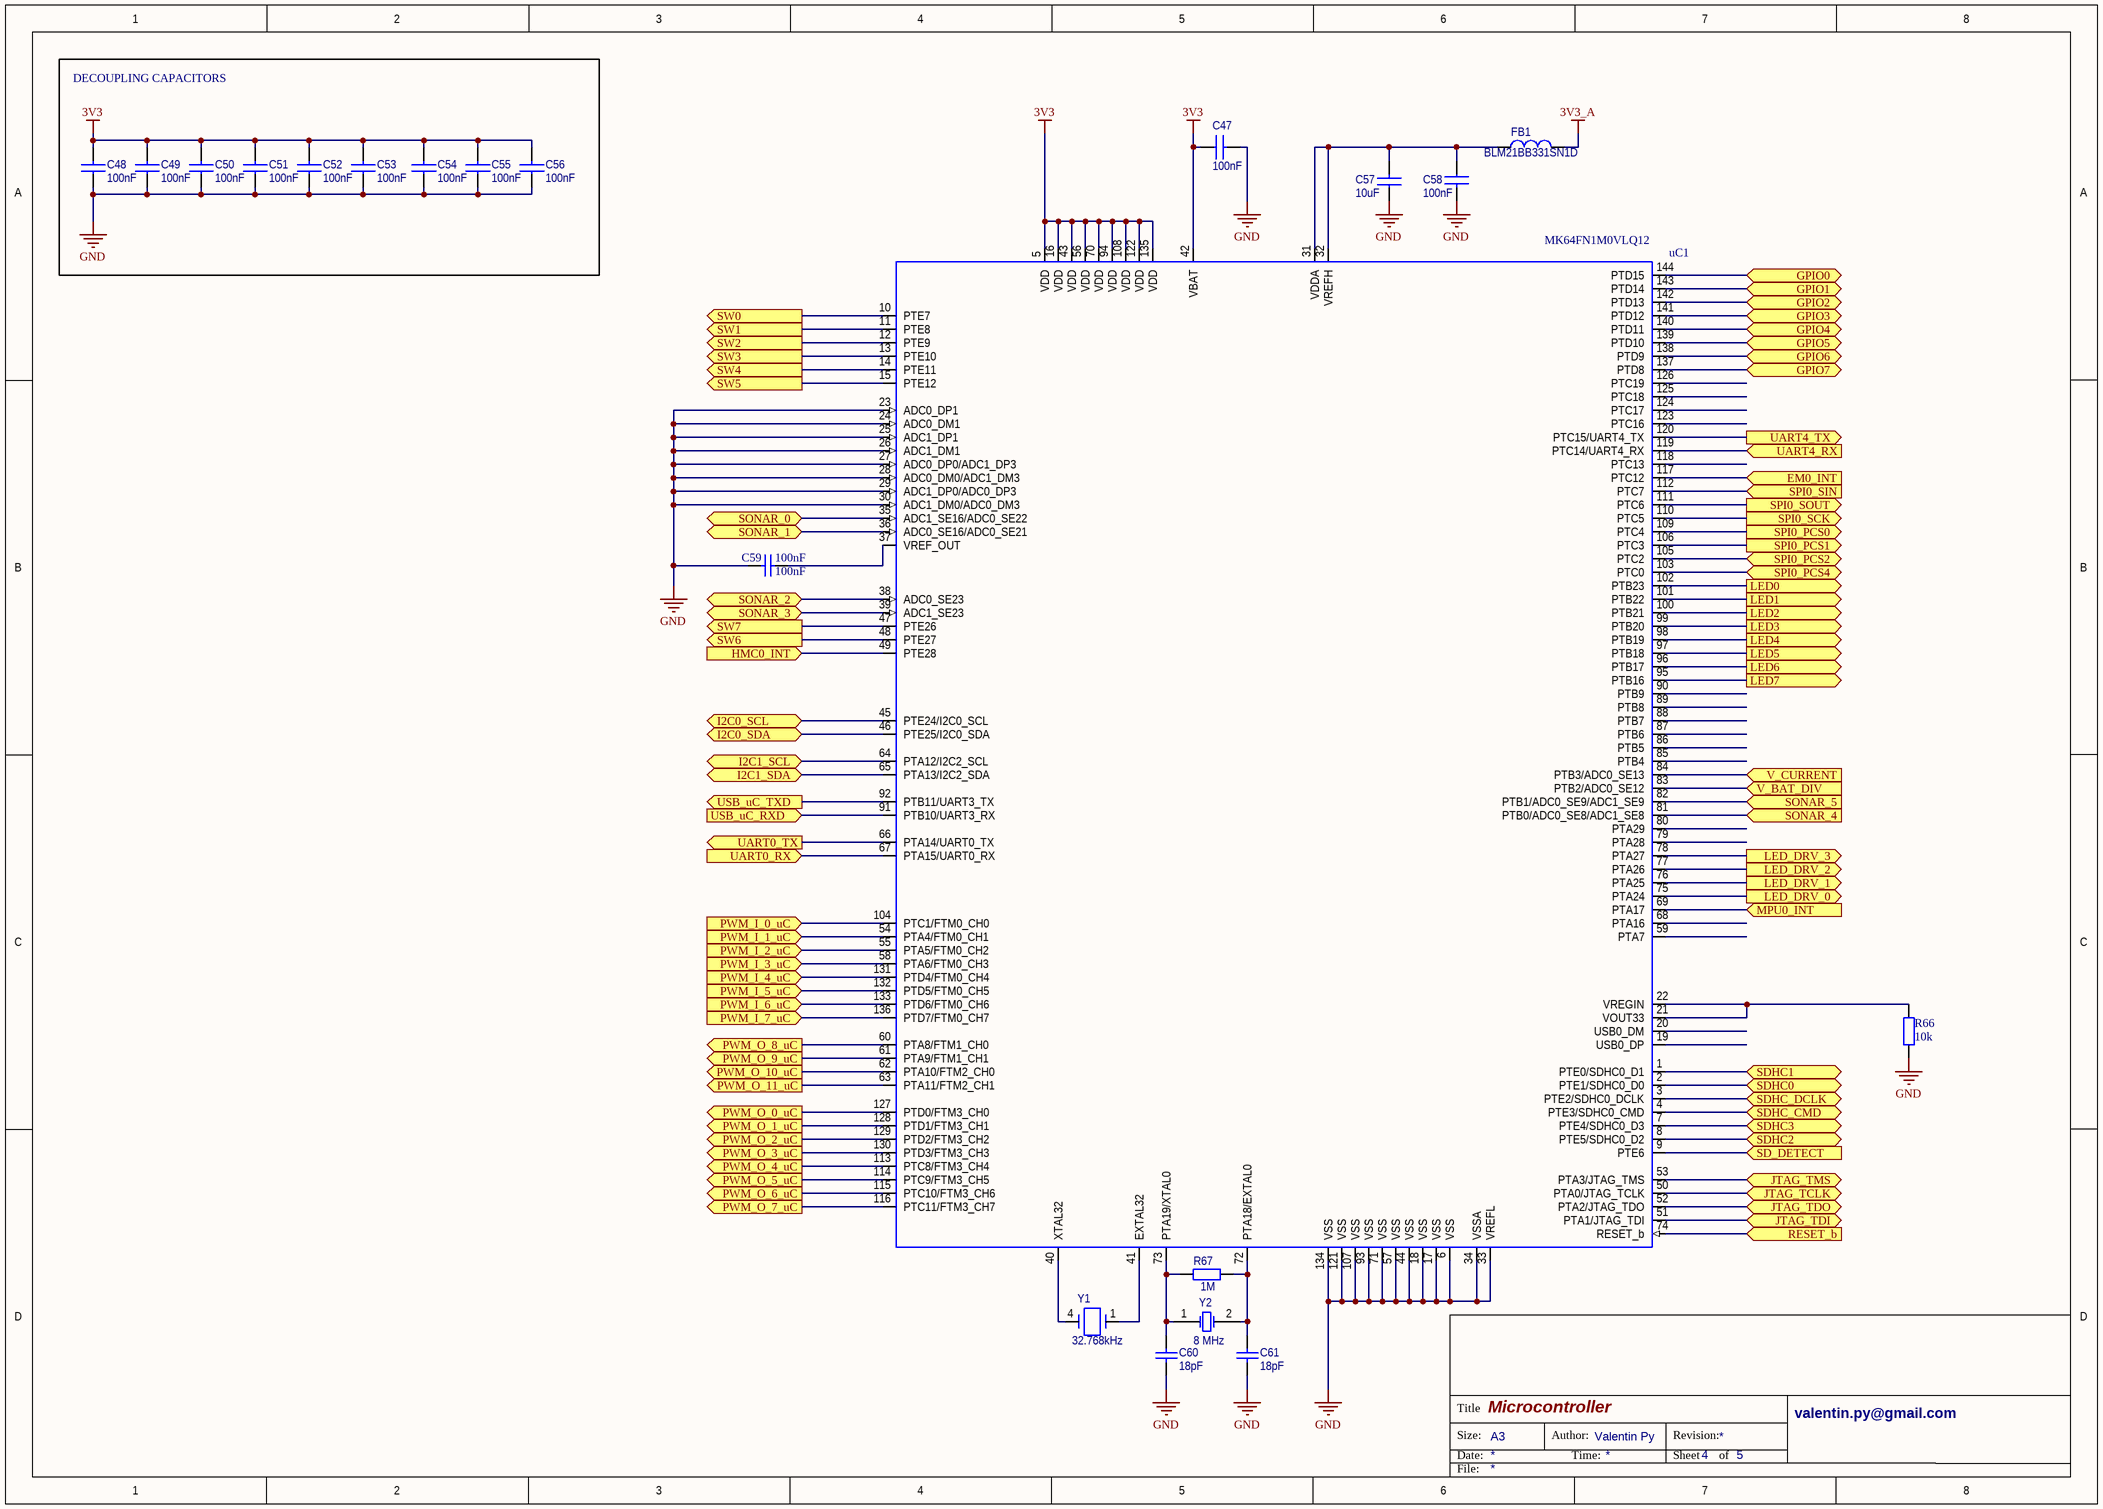
[diagram p4: uC.SchDoc]

### Parts
C47  100nF  [080503]
C48  100nF  [080503]
C49  100nF  [080503]
C50  100nF  [080503]
C51  100nF  [080503]
C52  100nF  [080503]
C53  100nF  [080503]
C54  100nF  [080503]
C55  100nF  [080503]
C56  100nF  [080503]
C57  10uF  [080503]
C58  100nF  [080503]
C59  100nF  [080503]
C60  18pF  [060301]
C61  18pF  [060301]
FB1  BLM21BB331SN1D  [080501]
R66  10k  [060301]
R67  1M  [060301]
uC1  MK64FN1M0VLQ12  [LQFP 144]
Y1  value 32.768kHz  [XT-5]  (hidden comment: CRYSTAL 32.768k)
Y2  value 8 MHz  [XT8_2-SMD]  (hidden comment: ABM3-8.000MHZ-D2Y-T)

### Blocks framed on the sheet
DECOUPLING CAPACITORS: C48-C56

### Ports
EM0_INT (in), GPIO0 (bidir), GPIO1 (bidir), GPIO2 (bidir), GPIO3 (bidir), GPIO4 (bidir), GPIO5 (bidir), GPIO6 (bidir), GPIO7 (bidir), HMC0_INT (in), I2C0_SCL (bidir), I2C0_SDA (bidir), I2C1_SCL (bidir), I2C1_SDA, JTAG_TCLK, JTAG_TDI, JTAG_TDO, JTAG_TMS, LED0 (out), LED1 (out), LED2 (out), LED3 (out), LED4 (out), LED5 (out), LED6 (out), LED7 (out), LED_DRV_0 (out), LED_DRV_1 (out), LED_DRV_2 (out), LED_DRV_3 (out), MPU0_INT (in), PWM_I_0_uC (in), PWM_I_1_uC (in), PWM_I_2_uC (in), PWM_I_3_uC (in), PWM_I_4_uC (in), PWM_I_5_uC (in), PWM_I_6_uC (in), PWM_I_7_uC (in), PWM_O_0_uC (out), PWM_O_1_uC (out), PWM_O_2_uC (out), PWM_O_3_uC (out), PWM_O_4_uC (out), PWM_O_5_uC (out), PWM_O_6_uC (out), PWM_O_7_uC (out), PWM_O_8_uC (out), PWM_O_9_uC (out), PWM_O_10_uC (out), PWM_O_11_uC (out), RESET_b (in), SD_DETECT (in), SDHC0, SDHC1, SDHC2, SDHC3, SDHC_CMD, SDHC_DCLK, SONAR_0, SONAR_1, SONAR_2, SONAR_3, SONAR_4 (in), SONAR_5 (in), SPI0_PCS0 (out), SPI0_PCS1 (out), SPI0_PCS2, SPI0_PCS4, SPI0_SCK (out), SPI0_SIN (in), SPI0_SOUT (out), SW0 (out), SW1 (out), SW2 (out), SW3 (out), SW4 (out), SW5 (out), SW6 (out), SW7 (out), UART0_RX (in), UART0_TX (out), UART4_RX (in), UART4_TX (out), USB_uC_RXD (in), USB_uC_TXD (out), V_BAT_DIV (in), V_CURRENT (in)

### Nets
3V3: C47.1 C48.2 C49.2 C50.2 C51.2 C52.2 C53.2 C54.2 C55.2 C56.2 uC1.5(VDD) uC1.16(VDD) uC1.42(VBAT) uC1.43(VDD) uC1.56(VDD) uC1.70(VDD) uC1.94(VDD) uC1.108(VDD) uC1.122(VDD) uC1.135(VDD)
3V3_A: FB1.2
GND: C47.2 C48.1 C49.1 C50.1 C51.1 C52.1 C53.1 C54.1 C55.1 C56.1 C57.1 C58.2 C59.2 C60.1 C61.1 R66.1 uC1.6(VSS) uC1.17(VSS) uC1.18(VSS) uC1.23(ADC0_DP1) uC1.24(ADC0_DM1) uC1.25(ADC1_DP1) uC1.26(ADC1_DM1) uC1.27(ADC0_DP0/ADC1_DP3) uC1.28(ADC0_DM0/ADC1_DM3) uC1.29(ADC1_DP0/ADC0_DP3) uC1.30(ADC1_DM0/ADC0_DM3) uC1.33(VREFL) uC1.34(VSSA) uC1.44(VSS) uC1.57(VSS) uC1.71(VSS) uC1.93(VSS) uC1.107(VSS) uC1.121(VSS) uC1.134(VSS)
GPIO0: uC1.144(PTD15) ; port GPIO0
GPIO1: uC1.143(PTD14) ; port GPIO1
GPIO2: uC1.142(PTD13) ; port GPIO2
GPIO3: uC1.141(PTD12) ; port GPIO3
GPIO4: uC1.140(PTD11) ; port GPIO4
GPIO5: uC1.139(PTD10) ; port GPIO5
GPIO6: uC1.138(PTD9) ; port GPIO6
GPIO7: uC1.137(PTD8) ; port GPIO7
I2C0_SCL: uC1.45(PTE24/I2C0_SCL) ; port I2C0_SCL
I2C0_SDA: uC1.46(PTE25/I2C0_SDA) ; port I2C0_SDA
I2C1_SCL: uC1.64(PTA12/I2C2_SCL) ; port I2C1_SCL
I2C1_SDA: uC1.65(PTA13/I2C2_SDA) ; port I2C1_SDA
JTAG_TCLK: uC1.50(PTA0/JTAG_TCLK) ; port JTAG_TCLK
JTAG_TDI: uC1.51(PTA1/JTAG_TDI) ; port JTAG_TDI
JTAG_TDO: uC1.52(PTA2/JTAG_TDO) ; port JTAG_TDO
JTAG_TMS: uC1.53(PTA3/JTAG_TMS) ; port JTAG_TMS
LED0_uC: uC1.102(PTB23) ; port LED0
LED1_uC: uC1.101(PTB22) ; port LED1
LED2_uC: uC1.100(PTB21) ; port LED2
LED3_uC: uC1.99(PTB20) ; port LED3
LED4_uC: uC1.98(PTB19) ; port LED4
LED5_uC: uC1.97(PTB18) ; port LED5
LED6_uC: uC1.96(PTB17) ; port LED6
LED7_uC: uC1.95(PTB16) ; port LED7
PWM_O_0_uC: uC1.127(PTD0/FTM3_CH0) ; port PWM_O_0_uC
PWM_O_1_uC: uC1.128(PTD1/FTM3_CH1) ; port PWM_O_1_uC
PWM_O_2_uC: uC1.129(PTD2/FTM3_CH2) ; port PWM_O_2_uC
PWM_O_3_uC: uC1.130(PTD3/FTM3_CH3) ; port PWM_O_3_uC
PWM_O_4_uC: uC1.113(PTC8/FTM3_CH4) ; port PWM_O_4_uC
PWM_O_5_uC: uC1.114(PTC9/FTM3_CH5) ; port PWM_O_5_uC
PWM_O_6_uC: uC1.115(PTC10/FTM3_CH6) ; port PWM_O_6_uC
PWM_O_7_uC: uC1.116(PTC11/FTM3_CH7) ; port PWM_O_7_uC
PWM_O_8_uC: uC1.60(PTA8/FTM1_CH0) ; port PWM_O_8_uC
PWM_O_9_uC: uC1.61(PTA9/FTM1_CH1) ; port PWM_O_9_uC
PWM_O_10_uC: uC1.62(PTA10/FTM2_CH0) ; port PWM_O_10_uC
PWM_O_11_uC: uC1.63(PTA11/FTM2_CH1) ; port PWM_O_11_uC
RESET_b: uC1.74(RESET_b) ; port RESET_b
S0_uC: uC1.35(ADC1_SE16/ADC0_SE22) ; port SONAR_0
S1_uC: uC1.36(ADC0_SE16/ADC0_SE21) ; port SONAR_1
S2_uC: uC1.38(ADC0_SE23) ; port SONAR_2
S3_uC: uC1.39(ADC1_SE23) ; port SONAR_3
S4_uC: uC1.81(PTB0/ADC0_SE8/ADC1_SE8) ; port SONAR_4
S5_uC: uC1.82(PTB1/ADC0_SE9/ADC1_SE9) ; port SONAR_5
SD_DETECT: uC1.9(PTE6) ; port SD_DETECT
SDHC0: uC1.2(PTE1/SDHC0_D0) ; port SDHC0
SDHC1: uC1.1(PTE0/SDHC0_D1) ; port SDHC1
SDHC2: uC1.8(PTE5/SDHC0_D2) ; port SDHC2
SDHC3: uC1.7(PTE4/SDHC0_D3) ; port SDHC3
SDHC_CMD: uC1.4(PTE3/SDHC0_CMD) ; port SDHC_CMD
SDHC_DCLK: uC1.3(PTE2/SDHC0_DCLK) ; port SDHC_DCLK
SPI0_PCS0: uC1.109(PTC4) ; port SPI0_PCS0
SPI0_PCS1: uC1.106(PTC3) ; port SPI0_PCS1
SPI0_PCS2: uC1.105(PTC2) ; port SPI0_PCS2
SPI0_PCS4: uC1.103(PTC0) ; port SPI0_PCS4
SPI0_SCK: uC1.110(PTC5) ; port SPI0_SCK
SPI0_SIN: uC1.112(PTC7) ; port SPI0_SIN
SPI0_SOUT: uC1.111(PTC6) ; port SPI0_SOUT
SW0: uC1.10(PTE7) ; port SW0
SW1: uC1.11(PTE8) ; port SW1
SW2: uC1.12(PTE9) ; port SW2
SW3: uC1.13(PTE10) ; port SW3
SW4: uC1.14(PTE11) ; port SW4
SW5: uC1.15(PTE12) ; port SW5
SW6: uC1.48(PTE27) ; port SW6
SW7: uC1.47(PTE26) ; port SW7
UART0_RX: uC1.67(PTA15/UART0_RX) ; port UART0_RX
UART0_TX: uC1.66(PTA14/UART0_TX) ; port UART0_TX
UART4_RX: uC1.119(PTC14/UART4_RX) ; port UART4_RX
UART4_TX: uC1.120(PTC15/UART4_TX) ; port UART4_TX
USB_uC_RXD: uC1.91(PTB10/UART3_RX) ; port USB_uC_RXD
USB_uC_TXD: uC1.92(PTB11/UART3_TX) ; port USB_uC_TXD
V_BAT_DIV: uC1.83(PTB2/ADC0_SE12) ; port V_BAT_DIV
V_CURRENT_uC: uC1.84(PTB3/ADC0_SE13) ; port V_CURRENT
NetC57_2: C57.2 C58.1 FB1.1 uC1.31(VDDA) uC1.32(VREFH)
NetC59_1: C59.1 uC1.37(VREF_OUT)
NetC60_2: C60.2 R67.1 uC1.73(PTA19/XTAL0) Y2.1(OSC1)
NetC61_2: C61.2 R67.2 uC1.72(PTA18/EXTAL0) Y2.2(OSC2)
NetD13_2: uC1.104(PTC1/FTM0_CH0) ; port PWM_I_0_uC
NetD14_2: uC1.54(PTA4/FTM0_CH1) ; port PWM_I_1_uC
NetD15_2: uC1.55(PTA5/FTM0_CH2) ; port PWM_I_2_uC
NetD16_2: uC1.58(PTA6/FTM0_CH3) ; port PWM_I_3_uC
NetD17_2: uC1.131(PTD4/FTM0_CH4) ; port PWM_I_4_uC
NetD18_2: uC1.132(PTD5/FTM0_CH5) ; port PWM_I_5_uC
NetD19_2: uC1.133(PTD6/FTM0_CH6) ; port PWM_I_6_uC
NetD20_2: uC1.136(PTD7/FTM0_CH7) ; port PWM_I_7_uC
NetEM1_4: uC1.117(PTC12) ; port EM0_INT
NetMAG1_15: uC1.49(PTE28) ; port HMC0_INT
NetMPU1_12: uC1.69(PTA17) ; port MPU0_INT
NetR1_1: uC1.75(PTA24) ; port LED_DRV_0
NetR3_1: uC1.76(PTA25) ; port LED_DRV_1
NetR4_1: uC1.77(PTA26) ; port LED_DRV_2
NetR5_1: uC1.78(PTA27) ; port LED_DRV_3
NetR66_2: R66.2 uC1.21(VOUT33) uC1.22(VREGIN)
NetuC1_40: uC1.40(XTAL32) Y1.4
NetuC1_41: uC1.41(EXTAL32) Y1.1

Not connected (* = marked no-connect by the designer): uC1 19(USB0_DP) 20(USB0_DM) 59(PTA7) 68(PTA16) 79(PTA28) 80(PTA29) 85(PTB4) 86(PTB5) 87(PTB6) 88(PTB7) 89(PTB8) 90(PTB9) 118(PTC13) 123(PTC16) 124(PTC17) 125(PTC18) 126(PTC19)

### Notes on the sheet
- Title
- Size:
- Date:
- A3
- Author:
- Time:
- Revision:
- Sheet
- of
- File:

### Library data of the parts
C47-C56 C58 = CAPA: CAP CER 0.1UF 25V 10% X7R 0805; Value: 100nF; Supplier 1: Digi-Key; Supplier Part Number 1: 1276-1099-1-ND
C57 = CAPA: CAP CER 10UF 16V 20% X6S 0805; Value: 10uF; Supplier 1: Digi-Key; Supplier Part Number 1: 445-7612-1-ND
C59 = CAP: CAP CER 0.1UF 25V 10% X7R 0805; Value: 100nF; Supplier 1: Digi-Key; Supplier Part Number 1: 1276-1099-1-ND
C60 C61 = Cap Semi: CAP CER 18PF 50V 5% NP0 0603; Value: 18pF; Supplier 1: Digi-Key; Supplier Part Number 1: 399-1052-6-ND
FB1 = Ferrite Bead: EMI Filter Beads, Chips & Arrays 0805 330 OHM; Value: 300R@100MHz; Supplier 1: Mouser; Supplier Part Number 1: 81-BLM21BB331SN1D
R66 = RES: RES 10K 0805; Value: 10k; Supplier 1: Digi-Key; Supplier Part Number 1: RHM10.0KCFCT-ND
R67 = RES: RES 1M 0603; Value: 1M; Supplier 1: Digi-Key; Supplier Part Number 1: 311-1.00MHRCT-ND
Y1 = Crystal_32: CRYSTAL 32.768 KHZ 12.5PF SMD; Supplier 1: Digi-Key; Supplier Part Number 1: XC1912CT-ND
Y2 = XTAL: CRYSTAL 8MHZ 18PF SMD; Supplier 1: Digi-Key; Supplier Part Number 1: 535-10630-6-ND
uC1 = MK64FN1M0VLQ12: Supplier 1: Digi-Key; Supplier Part Number 1: MK64FN1M0VLQ12-ND

## Nets that join several sheets
3V3: Power_supply (6 pins), Interfaces (27 pins), Sensors (25 pins), uC (20 pins)
3V3_A: Power_supply (C20.1 C22.2 U3.2 U3.4), Interfaces (12 pins), uC (FB1.2)
5V: Power_supply (5 pins), PWM (14 pins)
GND: Power_supply (21 pins), Interfaces (69 pins), Sensors (28 pins), PWM (46 pins), uC (36 pins)
V_BAT: Power_supply (8 pins), Interfaces (J2.1 J6.1 J8.1 J11.1)
GPIO0: Interfaces (J18.2), uC (uC1.144)
GPIO1: Interfaces (J18.3), uC (uC1.143)
GPIO2: Interfaces (J18.4), uC (uC1.142)
GPIO3: Interfaces (J18.5), uC (uC1.141)
GPIO4: Interfaces (J18.6), uC (uC1.140)
GPIO5: Interfaces (J18.7), uC (uC1.139)
GPIO6: Interfaces (J18.8), uC (uC1.138)
GPIO7: Interfaces (J18.9), uC (uC1.137)
I2C0_SCL: Interfaces (J1.3), Sensors (5 pins), uC (uC1.45)
I2C0_SDA: Interfaces (J1.2), Sensors (5 pins), uC (uC1.46)
I2C1_SCL: Interfaces (J4.3), Sensors (R63.1), uC (uC1.64)
I2C1_SDA: Interfaces (J4.2), Sensors (R62.1), uC (uC1.65)
JTAG_TCLK: Interfaces (J22.4 R31.2), uC (uC1.50)
JTAG_TDI: Interfaces (J22.8 R30.2), uC (uC1.51)
JTAG_TDO: Interfaces (J22.6), uC (uC1.52)
JTAG_TMS: Interfaces (J22.2 R32.1), uC (uC1.53)
LED0_uC: Interfaces (R6.1), uC (uC1.102)
LED1_uC: Interfaces (R7.1), uC (uC1.101)
LED2_uC: Interfaces (R8.1), uC (uC1.100)
LED3_uC: Interfaces (R15.1), uC (uC1.99)
LED4_uC: Interfaces (R16.1), uC (uC1.98)
LED5_uC: Interfaces (R17.1), uC (uC1.97)
LED6_uC: Interfaces (R18.1), uC (uC1.96)
LED7_uC: Interfaces (R25.1), uC (uC1.95)
NetD13_2: PWM (D13.2 R38.1), uC (uC1.104)
NetD14_2: PWM (D14.2 R39.1), uC (uC1.54)
NetD15_2: PWM (D15.2 R40.1), uC (uC1.55)
NetD16_2: PWM (D16.2 R41.1), uC (uC1.58)
NetD17_2: PWM (D17.2 R42.1), uC (uC1.131)
NetD18_2: PWM (D18.2 R43.1), uC (uC1.132)
NetD19_2: PWM (D19.2 R44.1), uC (uC1.133)
NetD20_2: PWM (D20.2 R45.1), uC (uC1.136)
NetEM1_4: Sensors (EM1.4), uC (uC1.117)
NetMAG1_15: Sensors (MAG1.15), uC (uC1.49)
NetMPU1_12: Sensors (MPU1.12), uC (uC1.69)
NetR1_1: Interfaces (R1.1), uC (uC1.75)
NetR3_1: Interfaces (R3.1), uC (uC1.76)
NetR4_1: Interfaces (R4.1), uC (uC1.77)
NetR5_1: Interfaces (R5.1), uC (uC1.78)
PWM_O_0_uC: PWM (U5.9), uC (uC1.127)
PWM_O_1_uC: PWM (U6.12), uC (uC1.128)
PWM_O_2_uC: PWM (U6.2), uC (uC1.129)
PWM_O_3_uC: PWM (U7.5), uC (uC1.130)
PWM_O_4_uC: PWM (U5.5), uC (uC1.113)
PWM_O_5_uC: PWM (U6.9), uC (uC1.114)
PWM_O_6_uC: PWM (U7.12), uC (uC1.115)
PWM_O_7_uC: PWM (U7.2), uC (uC1.116)
PWM_O_8_uC: PWM (U5.12), uC (uC1.60)
PWM_O_9_uC: PWM (U5.2), uC (uC1.61)
PWM_O_10_uC: PWM (U6.5), uC (uC1.62)
PWM_O_11_uC: PWM (U7.9), uC (uC1.63)
RESET_b: Interfaces (J22.10 R29.1 SW3.A), uC (uC1.74)
S0_uC: Interfaces (C7.1 R9.2), uC (uC1.35)
S1_uC: Interfaces (C11.1 R19.2), uC (uC1.36)
S2_uC: Interfaces (C16.1 R26.2), uC (uC1.38)
S3_uC: Interfaces (C8.1 R10.2), uC (uC1.39)
S4_uC: Interfaces (C12.1 R20.2), uC (uC1.81)
S5_uC: Interfaces (C17.1 R27.2), uC (uC1.82)
SD_DETECT: Interfaces (J21.G1 R28.2), uC (uC1.9)
SDHC0: Interfaces (J21.P7), uC (uC1.2)
SDHC1: Interfaces (J21.P8), uC (uC1.1)
SDHC2: Interfaces (J21.P1), uC (uC1.8)
SDHC3: Interfaces (J21.P2), uC (uC1.7)
SDHC_CMD: Interfaces (J21.P3), uC (uC1.4)
SDHC_DCLK: Interfaces (J21.P5), uC (uC1.3)
SPI0_PCS0: Interfaces (J7.2), uC (uC1.109)
SPI0_PCS1: Interfaces (J10.2), uC (uC1.106)
SPI0_PCS2: Interfaces (J12.2), uC (uC1.105)
SPI0_PCS4: Interfaces (J15.2), uC (uC1.103)
SPI0_SCK: Interfaces (J7.3 J10.3 J12.3 J15.3), uC (uC1.110)
SPI0_SIN: Interfaces (J7.5 J10.5 J12.5 J15.5), uC (uC1.112)
SPI0_SOUT: Interfaces (J7.4 J10.4 J12.4 J15.4), uC (uC1.111)
SW0: Interfaces (R14.2 SW1.8), uC (uC1.10)
SW1: Interfaces (R13.2 SW1.7), uC (uC1.11)
SW2: Interfaces (R12.2 SW1.6), uC (uC1.12)
SW3: Interfaces (R11.2 SW1.5), uC (uC1.13)
SW4: Interfaces (R24.2 SW2.8), uC (uC1.14)
SW5: Interfaces (R23.2 SW2.7), uC (uC1.15)
SW6: Interfaces (R22.2 SW2.6), uC (uC1.48)
SW7: Interfaces (R21.2 SW2.5), uC (uC1.47)
UART0_RX: Interfaces (J9.3), uC (uC1.67)
UART0_TX: Interfaces (J9.2), uC (uC1.66)
UART4_RX: Interfaces (J3.3), uC (uC1.119)
UART4_TX: Interfaces (J3.2), uC (uC1.120)
USB_uC_RXD: Interfaces (U1.26), uC (uC1.91)
USB_uC_TXD: Interfaces (U1.25), uC (uC1.92)
V_BAT_DIV: Power_supply (C24.1 D11.2 R33.1 R35.1), uC (uC1.83)
V_CURRENT_uC: Sensors (C38.1 D21.2 R65.2), uC (uC1.84)